# Altium project Length Bar Comparator.PrjPcb (part 2 of 3)

## Sheet Stepping Motor DriverF.SchDoc
size A4
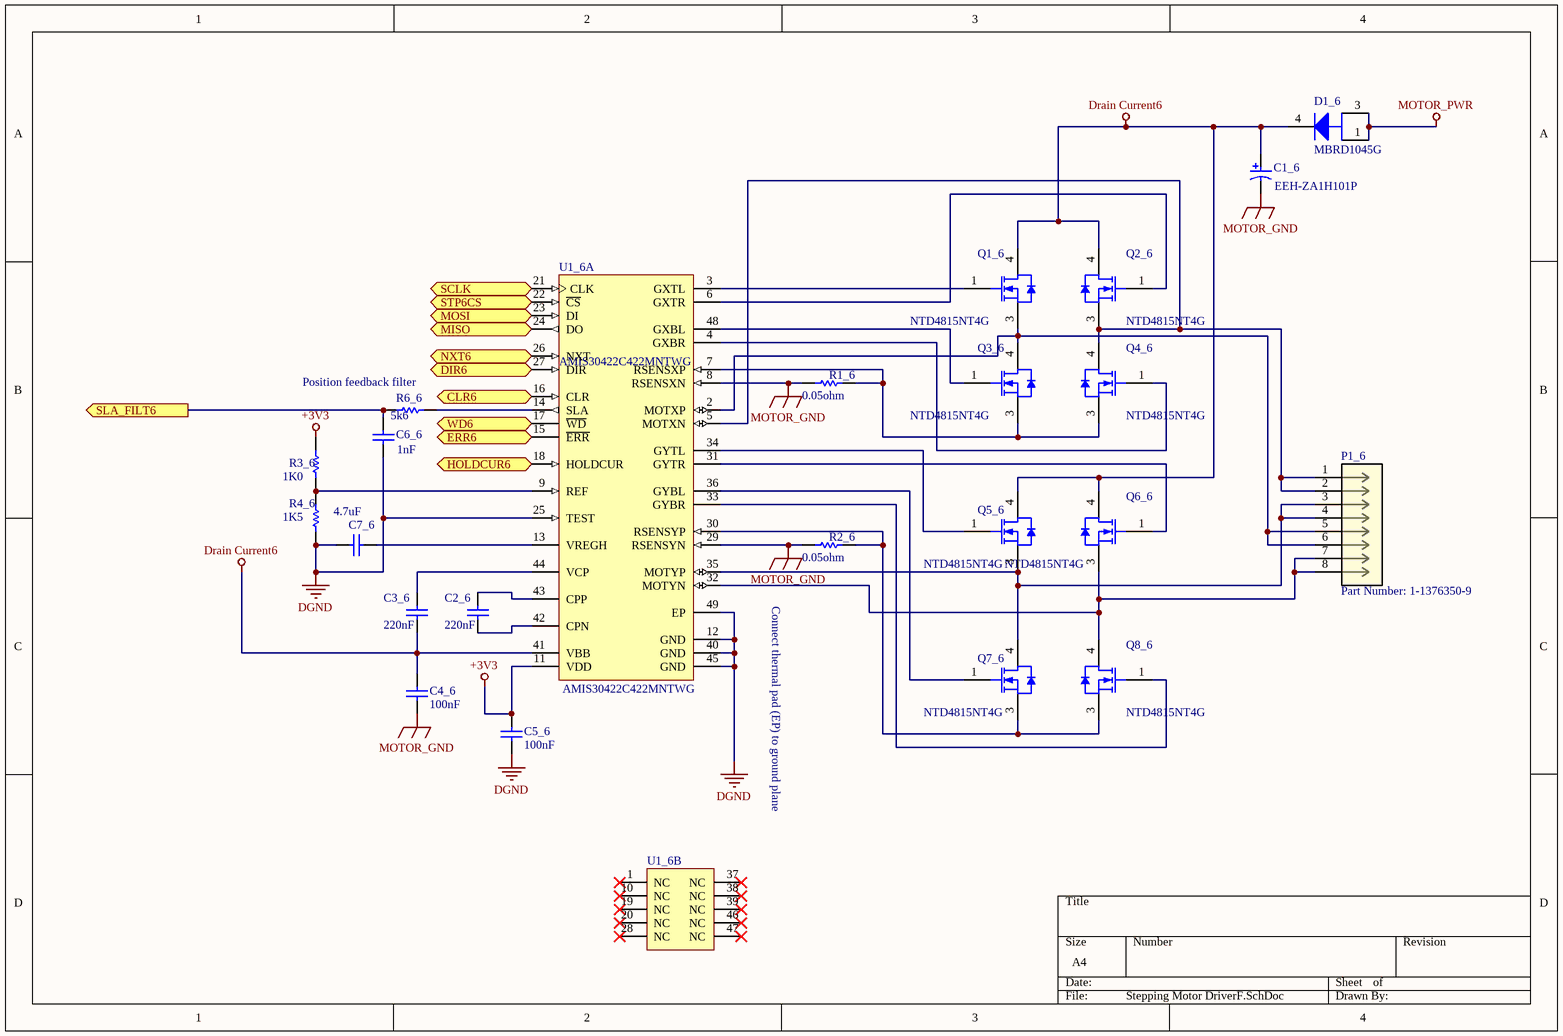
[diagram p5: Stepping Motor DriverF.SchDoc]

### Parts
C1_6  EEH-ZA1H101P  [PNSC-ZA-G_L]
C2_6  value 220nF  [CAPC0805(2012)75_L]  (hidden comment: CAP 220nF 50V 0805(2012))
C3_6  value 220nF  [CAPC0805(2012)75_L]  (hidden comment: CAP 220nF 50V 0805(2012))
C4_6  value 100nF  [CAPC1812(4532)110_N]  (hidden comment: CAP 100nF 50V 1812(4532))
C5_6  value 100nF  [CAPC1812(4532)110_N]  (hidden comment: CAP 100nF 50V 1812(4532))
C6_6  value 1nF  [CAPC1206(3216)170_N]  (hidden comment: CAP 1nF 50V 1206(3216))
C7_6  value 4.7uF  [CAPC2220(5750)230_L]  (hidden comment: CAP 4.7uF 50V 2220(5750))
D1_6  MBRD1045G  [ONSC-DPAK-3-369C-01_V]
P1_6  Part Number: 1-1376350-9  [conn8_1-1376350-]
Q1_6  NTD4815NT4G  [ONSC-DPAK-3-369AA-01_V]
Q2_6  NTD4815NT4G  [ONSC-DPAK-3-369AA-01_V]
Q3_6  NTD4815NT4G  [ONSC-DPAK-3-369AA-01_V]
Q4_6  NTD4815NT4G  [ONSC-DPAK-3-369AA-01_V]
Q5_6  NTD4815NT4G  [ONSC-DPAK-3-369AA-01_V]
Q6_6  NTD4815NT4G  [ONSC-DPAK-3-369AA-01_V]
Q7_6  NTD4815NT4G  [ONSC-DPAK-3-369AA-01_V]
Q8_6  NTD4815NT4G  [ONSC-DPAK-3-369AA-01_V]
R1_6  Resistance: 0.05ohm  [RESC6432X89X76LL25T25]  (hidden comment: WSL2512R0500FEA)
R2_6  Resistance: 0.05ohm  [RESC6432X89X76LL25T25]  (hidden comment: WSL2512R0500FEA)
R3_6  value 1K0  [RESC0805(2012)_M]  (hidden comment: 1K 1% 0805(2012))
R4_6  value 1K5  [RESC0805(2012)_M]  (hidden comment: 1K5 1% 0805(2012))
R6_6  value 5k6  [RESC0805(2012)_L]  (hidden comment: 5K6 1% 0805(2012))
U1_6  AMIS30422C422MNTWG  [ONSC-QFN-48-485AJ-01_V]  (parts A,B of 2)

### Ports
CLR6 (in), DIR6 (in), ERR6 (out), HOLDCUR6 (in), MISO (out), MOSI (in), NXT6 (in), SCLK (in), SLA_FILT6 (out), STP6CS (in), WD6 (out)

### Nets
+3V3: C5_6.2 R3_6.2 U1_6.11(VDD)
DGND: C5_6.1 C6_6.1 C7_6.1 R4_6.1 U1_6.12(GND) U1_6.25(TEST) U1_6.40(GND) U1_6.45(GND) U1_6.49(EP)
Drain Current6: C1_6.1 C3_6.1 C4_6.2 D1_6.4(K) Q1_6.4(D) Q2_6.4(D) Q5_6.4(D) Q6_6.4(D) U1_6.41(VBB)
MOTOR_GND: C1_6.2 C4_6.1 R1_6.1 R2_6.1 U1_6.8(RSENSXN) U1_6.29(RSENSYN)
MOTOR_PWR: D1_6.1(A) D1_6.3(A)
MISO: U1_6.24(DO) ; port MISO
MOSI: U1_6.23(DI) ; port MOSI
SCLK: U1_6.21(CLK) ; port SCLK
NetC2_6_1: C2_6.1 U1_6.42(CPN)
NetC2_6_2: C2_6.2 U1_6.43(CPP)
NetC3_6_2: C3_6.2 U1_6.44(VCP)
NetC6_6_2: C6_6.2 R6_6.1 ; port SLA_FILT6
NetC7_6_2: C7_6.2 U1_6.13(VREGH)
NetP1_6_1: P1_6.1 P1_6.2 Q2_6.3(S) Q4_6.4(D) U1_6.5(MOTXN)
NetP1_6_3: P1_6.3 P1_6.4 Q5_6.3(S) Q7_6.4(D) U1_6.35(MOTYP)
NetP1_6_5: P1_6.5 P1_6.6 Q1_6.3(S) Q3_6.4(D) U1_6.2(MOTXP)
NetP1_6_7: P1_6.7 P1_6.8 Q6_6.3(S) Q8_6.4(D) U1_6.32(MOTYN)
NetQ1_6_1: Q1_6.1(G) U1_6.3(GXTL)
NetQ2_6_1: Q2_6.1(G) U1_6.6(GXTR)
NetQ3_6_1: Q3_6.1(G) U1_6.48(GXBL)
NetQ3_6_3: Q3_6.3(S) Q4_6.3(S) R1_6.2 U1_6.7(RSENSXP)
NetQ4_6_1: Q4_6.1(G) U1_6.4(GXBR)
NetQ5_6_1: Q5_6.1(G) U1_6.34(GYTL)
NetQ6_6_1: Q6_6.1(G) U1_6.31(GYTR)
NetQ7_6_1: Q7_6.1(G) U1_6.36(GYBL)
NetQ7_6_3: Q7_6.3(S) Q8_6.3(S) R2_6.2 U1_6.30(RSENSYP)
NetQ8_6_1: Q8_6.1(G) U1_6.33(GYBR)
NetR3_6_1: R3_6.1 R4_6.2 U1_6.9(REF)
NetR6_6_2: R6_6.2 U1_6.14(SLA)
NetU1_6_15: U1_6.15(~{ERR}) ; port ERR6
NetU1_6_16: U1_6.16(CLR) ; port CLR6
NetU1_6_17: U1_6.17(~{WD}) ; port WD6
NetU1_6_18: U1_6.18(HOLDCUR) ; port HOLDCUR6
NetU1_6_22: U1_6.22(~{CS}) ; port STP6CS
NetU1_6_26: U1_6.26(NXT) ; port NXT6
NetU1_6_27: U1_6.27(DIR) ; port DIR6

Not connected (* = marked no-connect by the designer): U1_6 1(NC)* 10(NC)* 19(NC)* 20(NC)* 28(NC)* 37(NC)* 38(NC)* 39(NC)* 46(NC)* 47(NC)*

### Notes on the sheet
- (near R6_6) Position feedback filter
- Connect thermal pad (EP) to ground plane

### Library data of the parts
C1_6 = CMP-2000-06221-1: Conductive Polymer Hybrid Aluminum Electrolytic Capacitor, 100 uF, +/- 20%, 50 V, -55 to 105 degC, 2-Pin SMD (G), RoHS, Tape and Reel; Case Height: 10.5mm; Voltage Rating DC: 50V; Case Diameter: 10mm; Ripple Current: 2A; Load Life: 10000Hour; Brand: Panasonic; Case Length: 10.2mm; ESR: 28mOhms; Capacitance: 100uF; Manufacturer URL: http://www.panasonic.com/; Minimum Operating Temperature: -55C; Datasheet Version: 06/2016; Product Category: AluminumOrganicPolymerCapacitors; Maximum Operating Temperature: +105C; Package Description: 2-Pin Surface Mount Device, Body 10.3 x 10.3 mm; Package Reference: ZA-G; RoHS: Details; Series: ZA; Tolerance: 20%; Product: AluminumElectrolyticCapacitors; Factory Pack Quantity: 500; Manufacturer: Panasonic; Termination Style: SMD/SMT; Datasheet URL: https://industrial.panasonic.com/cdbs/www-data/pdf/RDD0000/DMD0000COL56.pdf; Mounting Technology: SurfaceMount; Packaging: Reel; Height: 10.5mm
C2_6 C3_6 = CMP-1036-04556-1: CAP 220nF 50V -20% to +80% 0805 (2012 Metric) Thickness 0.75mm SMD; Case-Metric: 2012; Case-EIA: 0805; Technology: SMT; Max Thickness: 0.75 mm; Rated Voltage: 50 V; Tolerance: -20% to +80%
C4_6 C5_6 = CMP-1040-01292-1: CAP 100nF 50V ±20% 1812 (4532 Metric) Thickness 1.1mm SMD; Case-EIA: 1812; Tolerance: Â±20%; Case-Metric: 4532; Rated Voltage: 50 V; Technology: SMT; Max Thickness: 1.1 mm
C6_6 = CMP-1037-02447-1: CAP 1nF 50V ±2% 1206 (3216 Metric) Thickness 1.7mm SMD; Case-Metric: 3216; Case-EIA: 1206; Tolerance: Â±2%; Technology: SMT; Max Thickness: 1.7 mm; Rated Voltage: 50 V
C7_6 = CMP-1042-00755-1: as C7_1 on sheet Stepping Motor DriverA; Rated Voltage: 50 V; Max Thickness: 2.2 mm; Technology: SMT
D1_6 = CMP-1055-00174-1: SWITCHMODE(TM) Schottky Power Rectifier, 3-Pin DPAK, Pb-Free, Tube; Manufacturer: On Semiconductor; Note1: 0; IFSM Max (A): 70; Configuration: Single; ComponentLink2URL: http://www.onsemi.cn/pub_link/Collateral/MBRB1045-D.PDF; PackageVersion: Rev. E, 02/2014; PackageDescription: 3-Pin Flange Mount, Body 6.54 x 6.095 mm, Pitch 2.29 mm; ComponentLink2Description: Datasheet; Packing: Tube; RoHS: TRUE; ComponentLink3Description: Package Specification; PackageReference: DPAK-3-369C-01; ComponentLink1URL: http://www.onsemi.com/; DatasheetVersion: Rev. 8; ComponentLink1Description: Manufacturer URL; PartNumber: MBRD1045G; Mounting Technology: Surface Mount; ComponentLink3URL: http://www.onsemi.cn/pub_link/Collateral/369C.PDF
P1_6 = 1-1376350-9: 025 8POS CAP ASSY H TIN; Vendor: TE Connectivity; Built_By: Digital_Papaya_Team; ROWS/CONFIG: 2; PITCH(MM): 0.087; POSITIONS: 8; Copyright: Copyright (C) 2018 Accelerated Designs. All rights reserved; Manufacturer_Part_Number: 1-1376350-9; Datasheet: https://www.te.com/commerce/DocumentDelivery/DDEController?Action=showdoc&DocId=Customer+Drawing%7F1376350%7FD5%7Fpdf%7FJapanese%7FJPN_CD_1376350_D5.pdf%7F1-1376350-2; TE_Part_Number: 1-1376350-9; PRODUCT: -; Type: DEV; RefDes: RefDes; Value: Value
Q1_6 Q2_6 Q3_6 Q4_6 Q5_6 Q6_6 Q7_6 Q8_6 = CMP-1058-00298-1: Power MOSFET, 30 V, 35 A, Single N-Channel, 3-Pin DPAK, Pb-Free, Tape and Reel; Manufacturer: On Semiconductor; VGS(th) Max (V): 2.5; VGS Max (V): 20; ID Max (A): 35; Crss Typ (pF): 108; Coss Typ (pF): 181; Channel Polarity: N Channel; V(BR)DSS Min (V): 30; Ciss Typ (pF): 770; Qrr Typ (nC): 5.5; RoHS: Pb-Free; ComponentLink3Description: Package Specification; ComponentLink2URL: http://www.onsemi.cn/pub_link/Collateral/NTD4815N-D.PDF; ComponentLink1Description: Manufacturer URL; DatasheetVersion: Rev. 7; ComponentLink3URL: http://www.onsemi.cn/pub_link/Collateral/369AA.PDF; Package Type: DPAK-3, IPAK-3; PartNumber: NTD4815NT4G; Configuration: Single; PackageVersion: Rev. B, 06/2010; ComponentLink2Description: Datasheet; Mounting Technology: Surface Mount; PackageReference: DPAK-3-369AA-01; ComponentLink1URL: http://www.onsemi.com/; PackageDescription: 3-Pin Flange Mount, Body 6.54 x 6.095 mm, Pitch 2.29 mm; Packing: Tape and Reel
R1_6 R2_6 = CMP-2000-07420-1: Chip Resistor, 50 mOhm, +/- 1%, 1 W, -65 to 170 degC, 2512 (6432 Metric), RoHS, Tape and Reel; Manufacturer: Vishay; Power Rating: 1W; Automotive Qualification Standard: AEC-Q200; Temperature Coefficient: ±75ppm/°C; Resistor Case Style: 2512[6432Metric]; SVHC: NoSVHC(15-Jun-2015); Product Range: WSLSeries; Resistor Element Type: MetalStrip; Manufacturer URL: http://www.vishay.com/; Datasheet Version: 07/2016; Package Reference: 2512; Resistance Tolerance: ±1%; Datasheet URL: http://www.vishay.com/docs/30100/wsl.pdf; Mounting Technology: SurfaceMount; MSL: MSL1-Unlimited; Package Description: 2-Pin Surface Mount Device, Body 6.35 x 3.18 mm; Packaging: CutTape
R3_6 = CMP-1013-00510-1: 1K 0.125W 1% 0805 (2012 Metric)  SMD; Case-Metric: 2012; Case-EIA: 0805; Tolerance: 1 %; Power: 0.125 W; Technology: SMT
R4_6 = CMP-1013-00528-1: 1K5 0.125W 1% 0805 (2012 Metric)  SMD; Case-Metric: 2012; Case-EIA: 0805; Technology: SMT; Power: 0.125 W; Tolerance: 1 %
R6_6 = CMP-1013-00595-1: as R6_1 on sheet Stepping Motor DriverA; Technology: SMT; Power: 0.125 W; Tolerance: 1 %
U1_6 = CMP-1325-00002-1: Micro-Stepping Stepper Motor Bridge Controller, 6 to 30 V, -40 to 170 degC, 48-Pin QFN (485AJ-01), RoHS, Tape and Reel; Manufacturer: ON Semiconductor; IO Max (A): 15; Feedback Method: Back EMF/Sensorless; VCC Min (V): 6; IO Peak Max (A): 20; Current Sense: External Resistor; VCC Max (V): 30; ComponentLink1Description: Manufacturer URL; DatasheetVersion: Rev. 0; PackageDescription: 48-Pin Quad Flat No-Lead Package, Body 7 x 7 mm, Pitch 0.5 mm; Packing: Tape and Reel; Mounting Technology: Surface Mount; ComponentLink2Description: Datasheet; ComponentLink3URL: http://www.onsemi.cn/pub_link/Collateral/485AJ.PDF; Type: Stepper; ComponentLink2URL: http://www.onsemi.com/pub_link/Collateral/AMIS-30422-D.PDF; ComponentLink3Description: Package Specification; PackageReference: QFN-48-485AJ-01; PartNumber: AMIS30422C422MNTWG; PackageVersion: Rev. O; ComponentLink1URL: http://www.onsemi.com/; RoHS: TRUE; PartId: 1

## Sheet Microprocessor.SchDoc
size A1
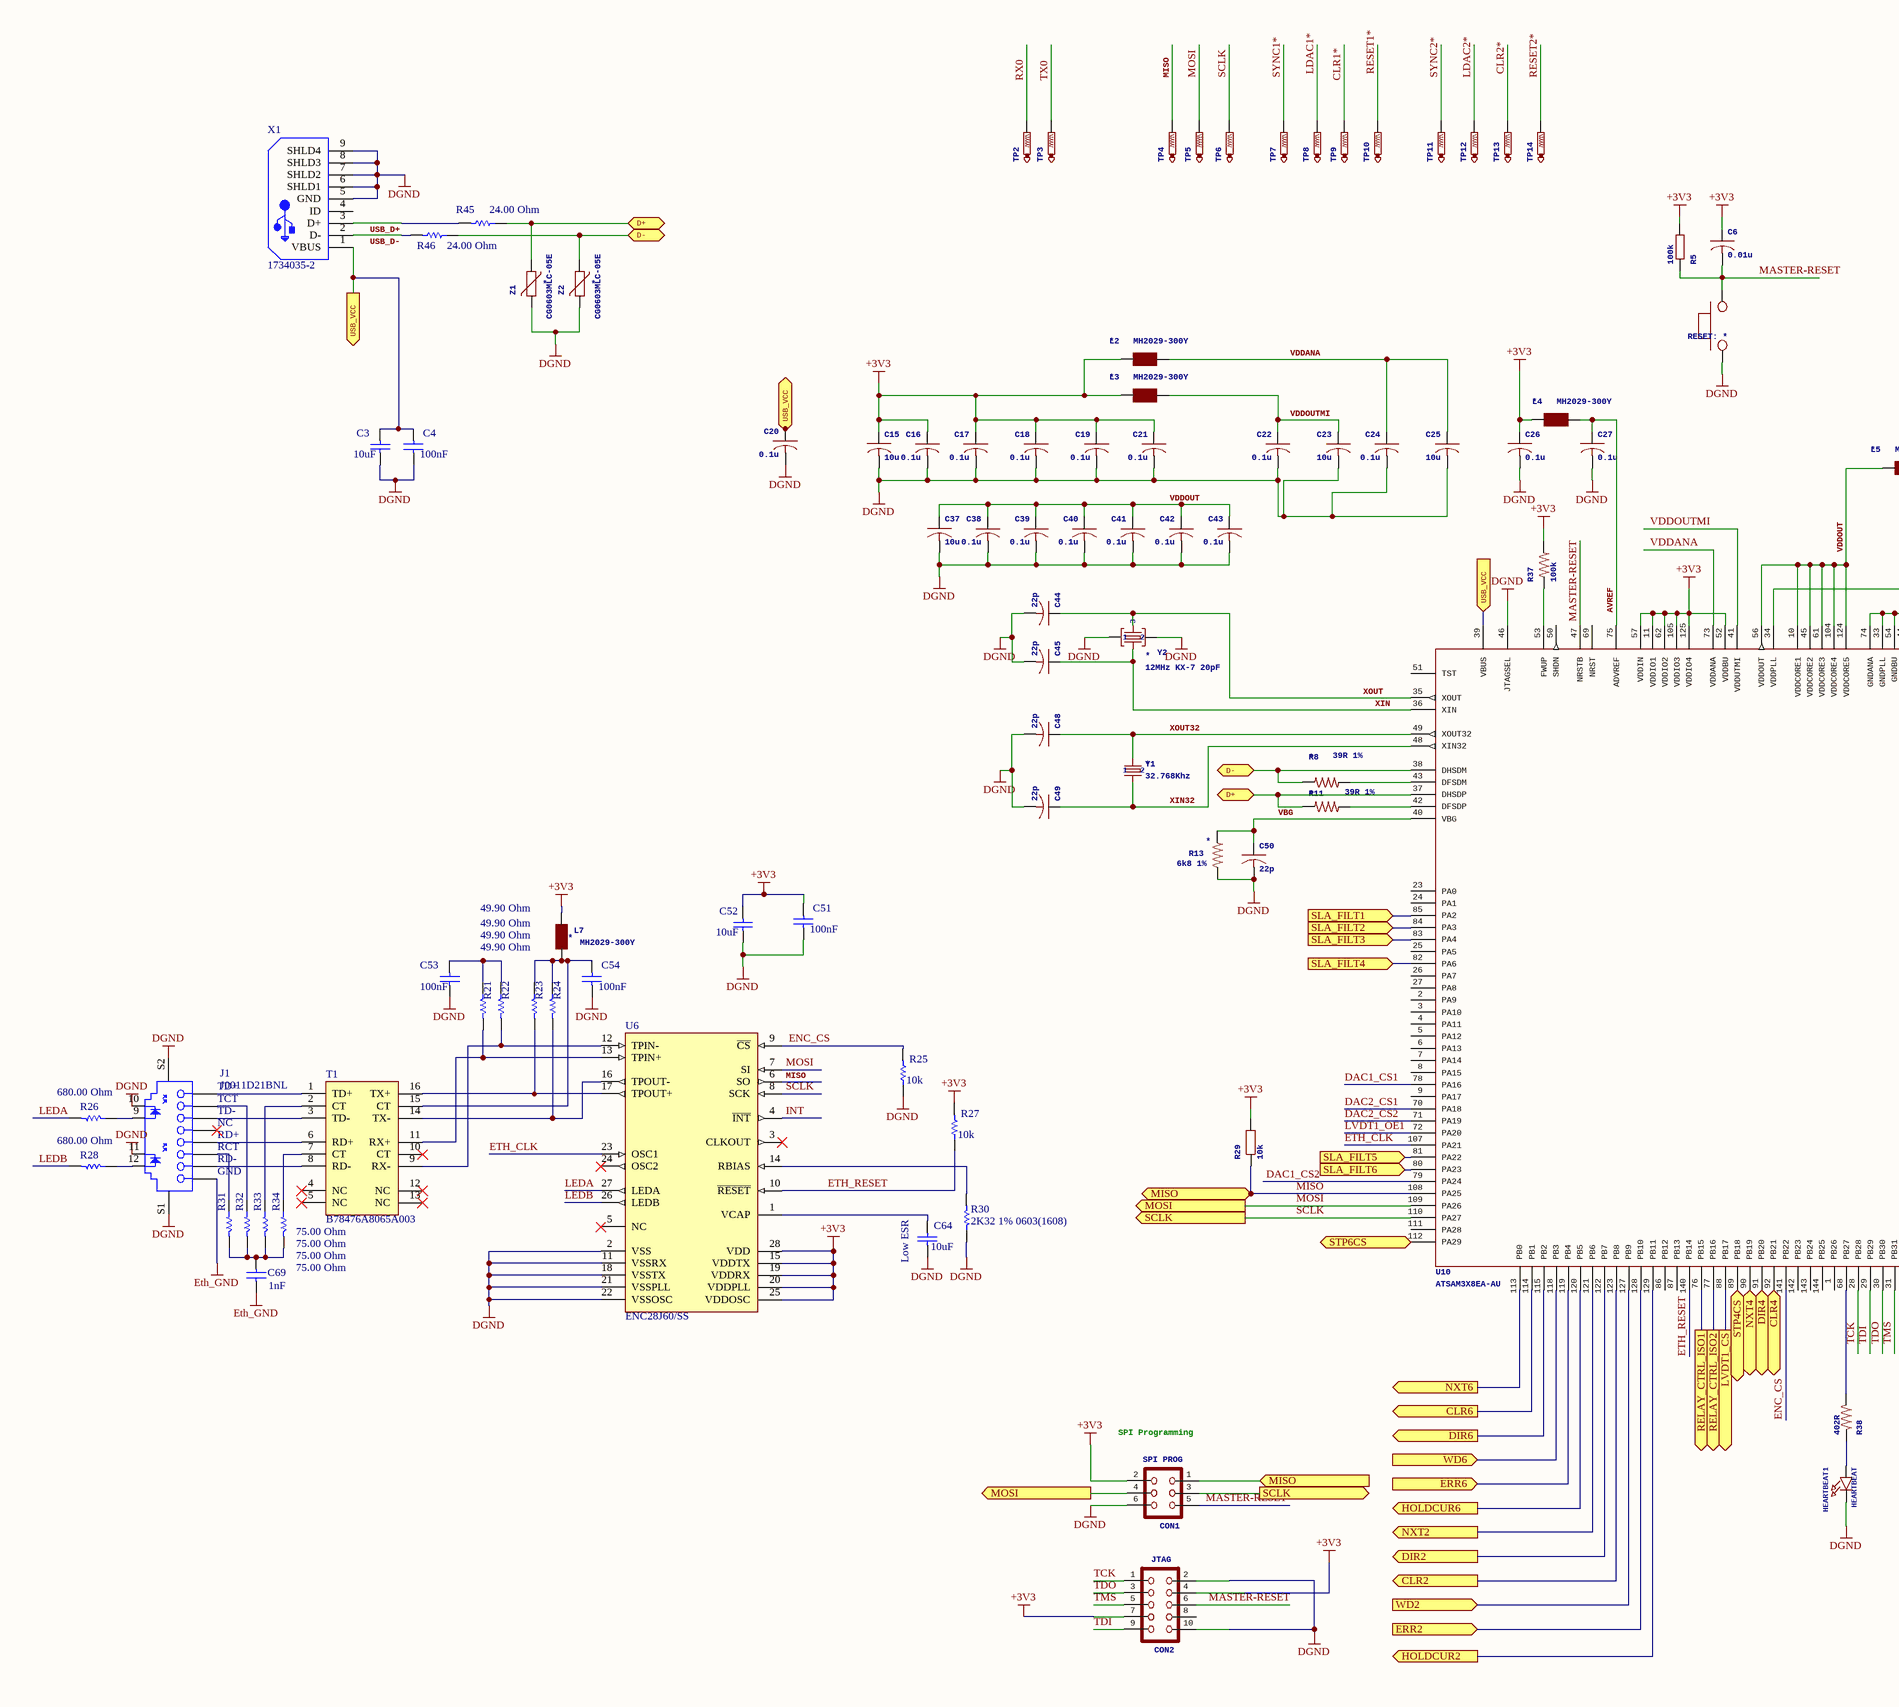
[diagram p6: Microprocessor.SchDoc, left]
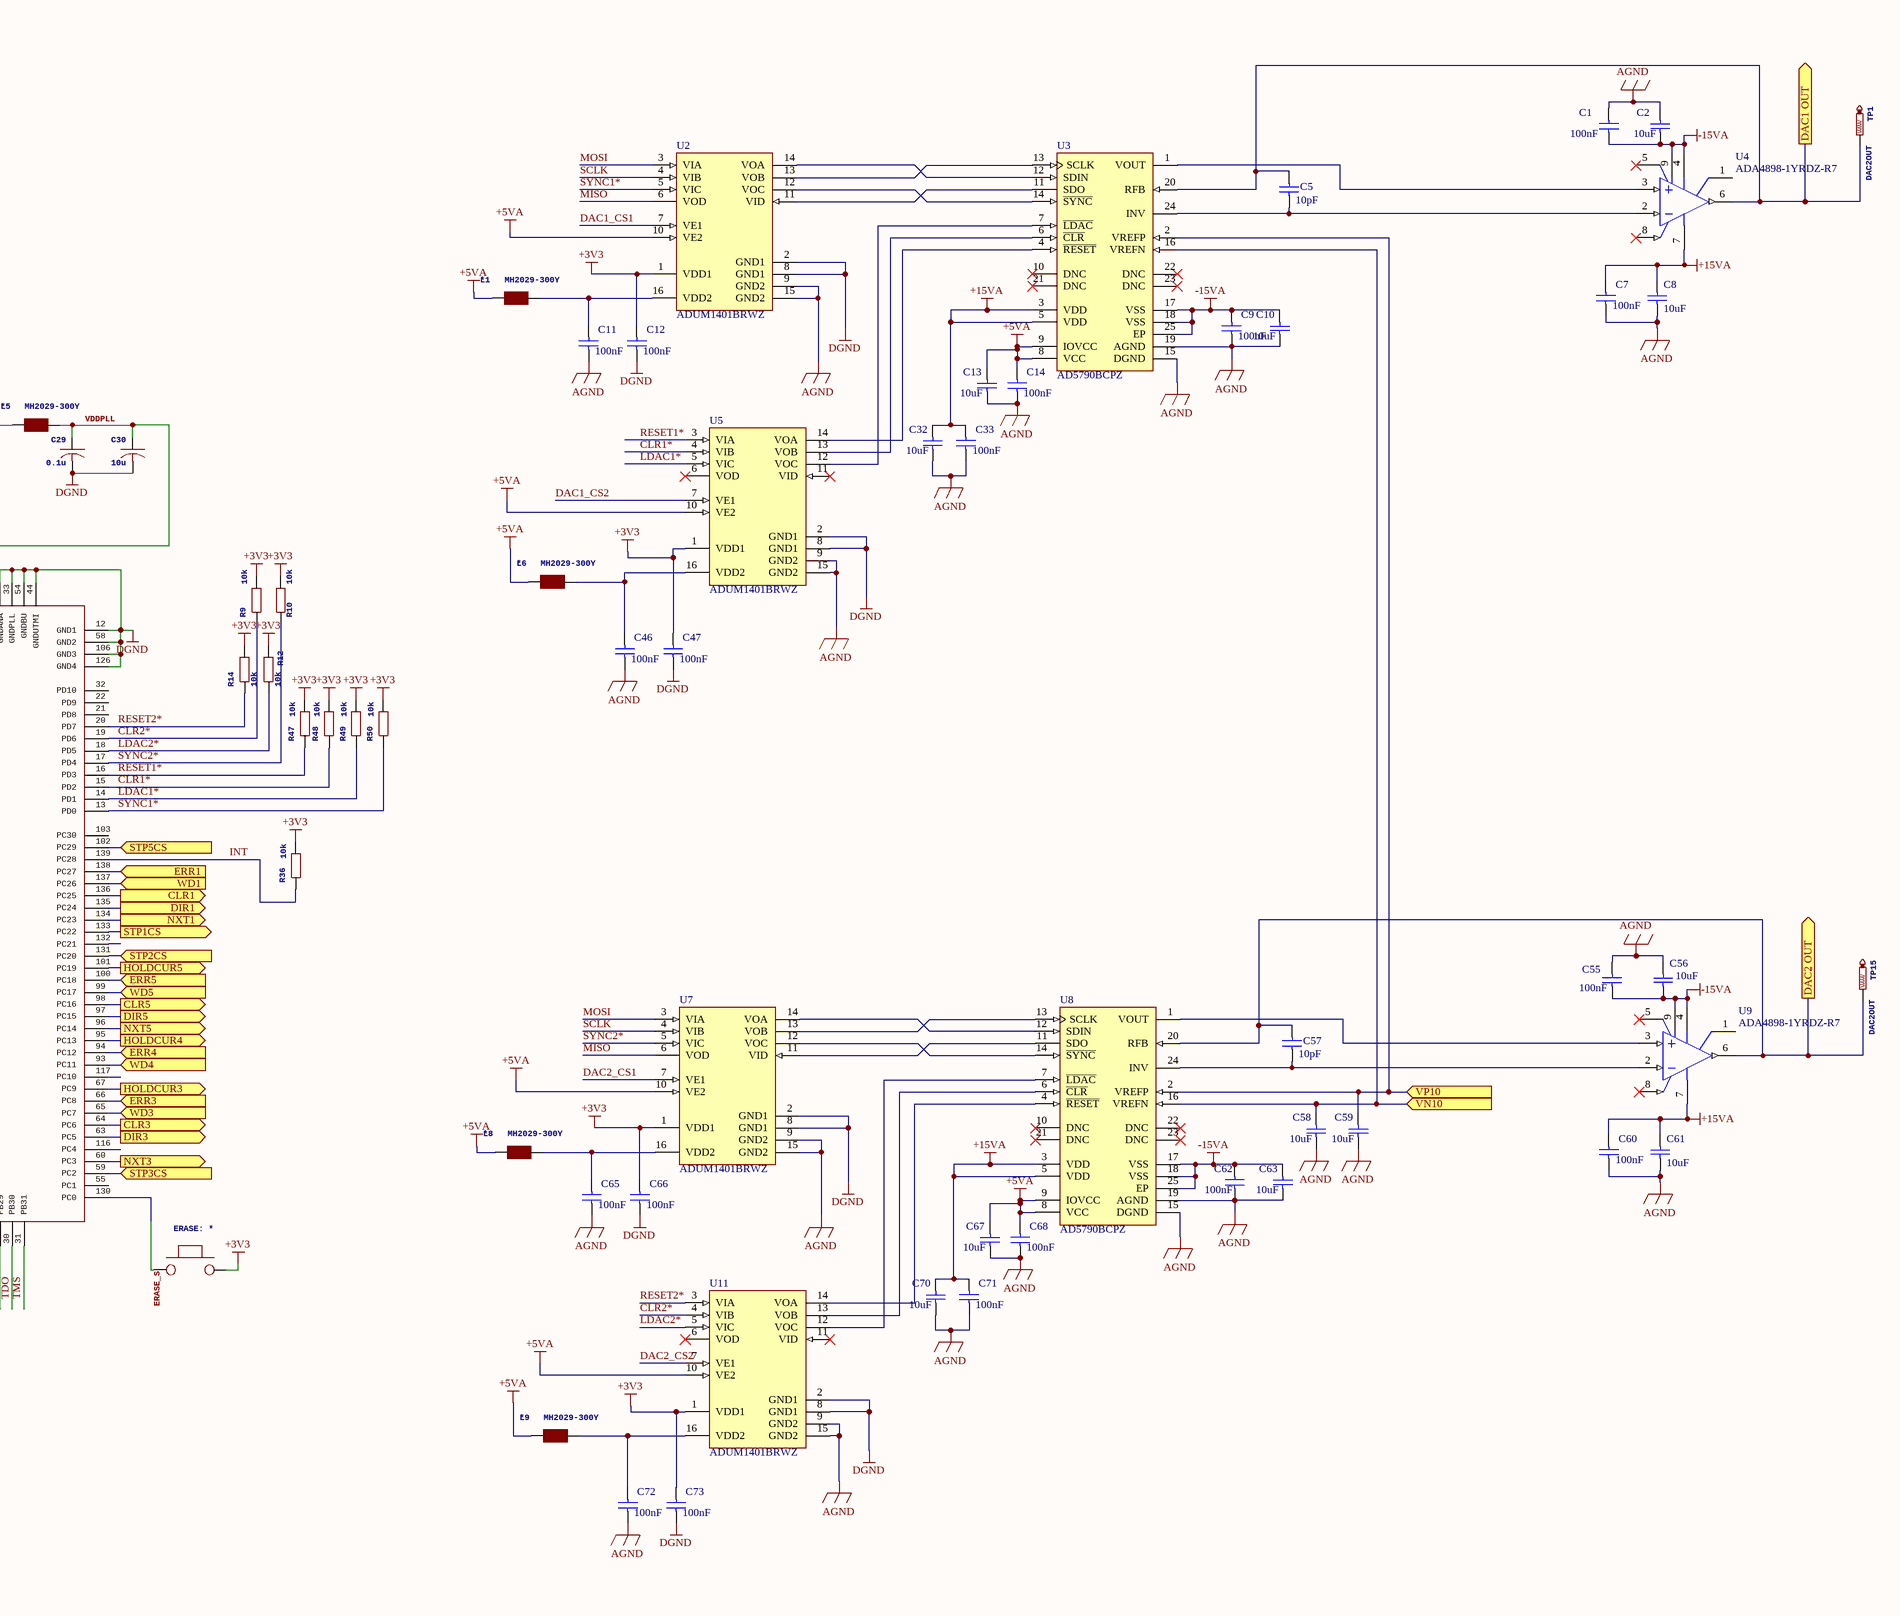
[diagram p7: Microprocessor.SchDoc, right]

### Parts
C1  value 100nF  [CAPC0603(1608)100_N]  (hidden comment: CAP 100nF 25V 0603(1608))
C2  value 10uF  [CAPC0805(2012)145_N]  (hidden comment: CAP 10uF 6.3V 0805(2012))
C3  value 10uF  [CAPC0805(2012)145_N]  (hidden comment: CAP 10uF 6.3V 0805(2012))
C4  value 100nF  [CAPC0603(1608)100_N]  (hidden comment: CAP 100nF 25V 0603(1608))
C5  value 10pF  [CAPC0805(2012)100_M]  (hidden comment: CAP 10pF 25V 0805(2012))
C6  0.01u  [C0805]
C7  value 100nF  [CAPC0603(1608)100_N]  (hidden comment: CAP 100nF 25V 0603(1608))
C8  value 10uF  [CAPC0805(2012)145_N]  (hidden comment: CAP 10uF 6.3V 0805(2012))
C9  value 100nF  [CAPC0603(1608)100_N]  (hidden comment: CAP 100nF 25V 0603(1608))
C10  value 10uF  [CAPC0805(2012)145_N]  (hidden comment: CAP 10uF 6.3V 0805(2012))
C11  value 100nF  [CAPC0603(1608)100_N]  (hidden comment: CAP 100nF 25V 0603(1608))
C12  value 100nF  [CAPC0603(1608)100_N]  (hidden comment: CAP 100nF 25V 0603(1608))
C13  value 10uF  [CAPC0805(2012)145_N]  (hidden comment: CAP 10uF 6.3V 0805(2012))
C14  value 100nF  [CAPC0603(1608)100_N]  (hidden comment: CAP 100nF 25V 0603(1608))
C15  10u  [C0805]
C16  0.1u  [C0805]
C17  0.1u  [C0805]
C18  0.1u  [C0805]
C19  0.1u  [C0805]
C20  0.1u  [C0805]
C21  0.1u  [C0805]
C22  0.1u  [C0805]
C23  10u  [C0805]
C24  0.1u  [C0805]
C25  10u  [C0805]
C26  0.1u  [C0805]
C27  0.1u  [C0805]
C29  0.1u  [C0805]
C30  10u  [C0805]
C32  value 10uF  [CAPC0805(2012)145_N]  (hidden comment: CAP 10uF 6.3V 0805(2012))
C33  value 100nF  [CAPC0603(1608)100_N]  (hidden comment: CAP 100nF 25V 0603(1608))
C37  10u  [C0805]
C38  0.1u  [C0805]
C39  0.1u  [C0805]
C40  0.1u  [C0805]
C41  0.1u  [C0805]
C42  0.1u  [C0805]
C43  0.1u  [C0805]
C44  22p  [C1206]
C45  22p  [C1206]
C46  value 100nF  [CAPC0603(1608)100_N]  (hidden comment: CAP 100nF 25V 0603(1608))
C47  value 100nF  [CAPC0603(1608)100_N]  (hidden comment: CAP 100nF 25V 0603(1608))
C48  22p  [C0805]
C49  22p  [C0805]
C50  22p  [C0805]
C51  value 100nF  [CAPC0603(1608)100_N]  (hidden comment: CAP 100nF 25V 0603(1608))
C52  value 10uF  [CAPC0805(2012)145_N]  (hidden comment: CAP 10uF 6.3V 0805(2012))
C53  value 100nF  [CAPC0603(1608)100_N]  (hidden comment: CAP 100nF 25V 0603(1608))
C54  value 100nF  [CAPC0603(1608)100_N]  (hidden comment: CAP 100nF 25V 0603(1608))
C55  value 100nF  [CAPC0603(1608)100_N]  (hidden comment: CAP 100nF 25V 0603(1608))
C56  value 10uF  [CAPC0805(2012)145_N]  (hidden comment: CAP 10uF 6.3V 0805(2012))
C57  value 10pF  [CAPC0805(2012)100_M]  (hidden comment: CAP 10pF 25V 0805(2012))
C58  value 10uF  [CAPC0805(2012)145_N]  (hidden comment: CAP 10uF 6.3V 0805(2012))
C59  value 10uF  [CAPC0805(2012)145_N]  (hidden comment: CAP 10uF 6.3V 0805(2012))
C60  value 100nF  [CAPC0603(1608)100_N]  (hidden comment: CAP 100nF 25V 0603(1608))
C61  value 10uF  [CAPC0805(2012)145_N]  (hidden comment: CAP 10uF 6.3V 0805(2012))
C62  value 100nF  [CAPC0603(1608)100_N]  (hidden comment: CAP 100nF 25V 0603(1608))
C63  value 10uF  [CAPC0805(2012)145_N]  (hidden comment: CAP 10uF 6.3V 0805(2012))
C64  value 10uF  [CAPC1206(3216)190_M]  (hidden comment: CAP 10uF 6.3V 1206(3216))
C65  value 100nF  [CAPC0603(1608)100_N]  (hidden comment: CAP 100nF 25V 0603(1608))
C66  value 100nF  [CAPC0603(1608)100_N]  (hidden comment: CAP 100nF 25V 0603(1608))
C67  value 10uF  [CAPC0805(2012)145_N]  (hidden comment: CAP 10uF 6.3V 0805(2012))
C68  value 100nF  [CAPC0603(1608)100_N]  (hidden comment: CAP 100nF 25V 0603(1608))
C69  Capacitance: 1nF  [CAPC3317X180X60LL30T20]  (hidden comment: 1206GC102KAZ1A)
C70  value 10uF  [CAPC0805(2012)145_N]  (hidden comment: CAP 10uF 6.3V 0805(2012))
C71  value 100nF  [CAPC0603(1608)100_N]  (hidden comment: CAP 100nF 25V 0603(1608))
C72  value 100nF  [CAPC0603(1608)100_N]  (hidden comment: CAP 100nF 25V 0603(1608))
C73  value 100nF  [CAPC0603(1608)100_N]  (hidden comment: CAP 100nF 25V 0603(1608))
CON1  SPI PROG  [CON06]
CON2  JTAG  [CON10]
ERASE1  PUCHBUTTON  [PUCHBUTTON]  (value not drawn)
HEARTBEAT1  HEARTBEAT  [CHIPLED_0805]
J1  J0011D21BNL  [PULS-J00XXD21XNL-B-12]
L1  MH2029-300Y  [0805]
L2  MH2029-300Y  [0805]
L3  MH2029-300Y  [0805]
L4  MH2029-300Y  [0805]
L5  MH2029-300Y  [0805]
L6  MH2029-300Y  [0805]
L7  MH2029-300Y  [0805]
L8  MH2029-300Y  [0805]
L9  MH2029-300Y  [0805]
R5  100k  [R0603]
R8  39R 1%  [R0805]
R9  10k  [R0603]
R10  10k  [R0603]
R11  39R 1%  [R0805]
R12  10k  [R0603]
R13  6k8 1%  [R0805]
R14  10k  [R0603]
R21  value 49.90 Ohm  [RESC0603(1608)_N]  (hidden comment: 49R9 1% 0603(1608))
R22  value 49.90 Ohm  [RESC0603(1608)_N]  (hidden comment: 49R9 1% 0603(1608))
R23  value 49.90 Ohm  [RESC0603(1608)_N]  (hidden comment: 49R9 1% 0603(1608))
R24  value 49.90 Ohm  [RESC0603(1608)_N]  (hidden comment: 49R9 1% 0603(1608))
R25  Resistance (Ohms): 10k  [RESC1608X55X30LL10T20_A]  (hidden comment: MCR03ERTF1002)
R26  value 680.00 Ohm  [RESC0603(1608)_N]  (hidden comment: 680R 1% 0603(1608))
R27  Resistance (Ohms): 10k  [RESC1608X55X30LL10T20_A]  (hidden comment: MCR03ERTF1002)
R28  value 680.00 Ohm  [RESC0603(1608)_N]  (hidden comment: 680R 1% 0603(1608))
R29  10k  [R0603]
R30  2K32 1% 0603(1608)  [RESC0603(1608)_L]
R31  value 75.00 Ohm  [RESC0603(1608)_M]  (hidden comment: 75R 1% 0603(1608))
R32  value 75.00 Ohm  [RESC0603(1608)_M]  (hidden comment: 75R 1% 0603(1608))
R33  value 75.00 Ohm  [RESC0603(1608)_M]  (hidden comment: 75R 1% 0603(1608))
R34  value 75.00 Ohm  [RESC0603(1608)_M]  (hidden comment: 75R 1% 0603(1608))
R36  10k  [R0603]
R37  100k  [R0805]
R38  402R  [R0805]
R45  value 24.00 Ohm  [RESC0603(1608)_N]  (hidden comment: 24R 5% 0603(1608))
R46  value 24.00 Ohm  [RESC0603(1608)_N]  (hidden comment: 24R 5% 0603(1608))
R47  10k  [R0603]
R48  10k  [R0603]
R49  10k  [R0603]
R50  10k  [R0603]
RESET1  PUCHBUTTON  [PUCHBUTTON]  (value not drawn)
T1  B78476A8065A003  [EPCS-B78476A8065A003-16]
TP1  TP_SIGNAL_NAME: DAC2OUT  [P1-13]  (hidden comment: PTR1PAD1-13)
TP2  PTR1PAD1-13  [P1-13]  (value not drawn)
TP3  PTR1PAD1-13  [P1-13]  (value not drawn)
TP4  PTR1PAD1-13  [P1-13]  (value not drawn)
TP5  PTR1PAD1-13  [P1-13]  (value not drawn)
TP6  PTR1PAD1-13  [P1-13]  (value not drawn)
TP7  PTR1PAD1-13  [P1-13]  (value not drawn)
TP8  PTR1PAD1-13  [P1-13]  (value not drawn)
TP9  PTR1PAD1-13  [P1-13]  (value not drawn)
TP10  PTR1PAD1-13  [P1-13]  (value not drawn)
TP11  PTR1PAD1-13  [P1-13]  (value not drawn)
TP12  PTR1PAD1-13  [P1-13]  (value not drawn)
TP13  PTR1PAD1-13  [P1-13]  (value not drawn)
TP14  PTR1PAD1-13  [P1-13]  (value not drawn)
TP15  TP_SIGNAL_NAME: DAC2OUT  [P1-13]  (hidden comment: PTR1PAD1-13)
U2  ADUM1401BRWZ  [ADI-RW-16_M]
U3  AD5790BCPZ  [CP-24-5_N]
U4  ADA4898-1YRDZ-R7  [ADI-RD-8-1_N]
U5  ADUM1401BRWZ  [ADI-RW-16_M]
U6  ENC28J60/SS  [SSOP-SS28_M]
U7  ADUM1401BRWZ  [ADI-RW-16_M]
U8  AD5790BCPZ  [CP-24-5_N]
U9  ADA4898-1YRDZ-R7  [ADI-RD-8-1_N]
U10  ATSAM3X8EA-AU  [LQFP144]
U11  ADUM1401BRWZ  [ADI-RW-16_M]
X1  1734035-2  [TECO-1734035-2-5_V]
Y1  32.768Khz  [ARDUINO_WIFI_SHIELD_V018_TG_RESONATOR_EPSON_FC_145]
Y2  12MHz KX-7 20pF  [CRYSTAL-3.2-2.5]
Z1  CG0603MLC-05E  [CT/CN0603]
Z2  CG0603MLC-05E  [CT/CN0603]

### Ports
CLR1 (out), CLR2 (out), CLR3 (out), CLR4 (out), CLR5 (out), CLR6 (out), D+, D-, DAC1 OUT (out), DAC2 OUT (out), DIR1 (out), DIR2 (out), DIR3 (out), DIR4 (out), DIR5 (out), DIR6 (out), ERR1 (in), ERR2 (in), ERR3 (in), ERR4 (in), ERR5 (in), ERR6 (in), HOLDCUR2 (out), HOLDCUR3 (out), HOLDCUR4 (out), HOLDCUR5 (out), HOLDCUR6 (out), LVDT1_CS (out), MISO (in), MOSI (out), NXT1 (out), NXT2 (out), NXT3 (out), NXT4 (out), NXT5 (out), NXT6 (out), RELAY_CTRL_ISO1 (out), RELAY_CTRL_ISO2 (out), SCLK (out), SLA_FILT1 (in), SLA_FILT2 (in), SLA_FILT3 (in), SLA_FILT4 (in), SLA_FILT5 (in), SLA_FILT6 (in), STP1CS (out), STP2CS (in), STP3CS (in), STP4CS (in), STP5CS (in), STP6CS (in), USB_VCC (in), USB_VCC (out), VN10 (in), VP10 (in), WD1 (in), WD2 (in), WD3 (in), WD4 (in), WD5 (in), WD6 (in)

### Nets
+3V3: C6.1 C12.1 C15.1 C16.1 C17.1 C18.1 C19.1 C21.1 C26.1 C47.1 C51.1 C52.2 C66.1 C73.1 CON1.2 CON2.4 CON2.7 ERASE1.P$2(P$5) L2.1 L3.1 L4.1 L7.1 R5.2 R9.2 R10.2 R12.2 R14.2 R27.2 R29.2 R36.2 R37.2 R47.2 R48.2 R49.2 R50.2 U2.1(VDD1) U5.1(VDD1) U6.15(VDDTX) U6.19(VDDRX) U6.20(VDDPLL) U6.25(VDDOSC) U6.28(VDD) U7.1(VDD1) U10.11(VDDIO1) U10.52(VDDBU) U10.57(VDDIN) U10.62(VDDIO2) U10.105(VDDIO3) U10.125(VDDIO4) U11.1(VDD1)
+5VA: C13.2 C14.1 C67.2 C68.1 L1.1 L6.1 L8.1 L9.1 U2.10(VE2) U3.8(VCC) U3.9(IOVCC) U5.10(VE2) U7.10(VE2) U8.8(VCC) U8.9(IOVCC) U11.10(VE2)
+15VA: C7.1 C8.2 C32.2 C33.1 C60.1 C61.2 C70.2 C71.1 U3.3(VDD) U3.5(VDD) U4.7(+VS) U8.3(VDD) U8.5(VDD) U9.7(+VS)
-15VA: C1.2 C2.1 C9.1 C10.2 C55.2 C56.1 C62.1 C63.2 U3.17(VSS) U3.18(VSS) U3.25(EP) U4.4(-VS) U4.9(EP) U8.17(VSS) U8.18(VSS) U8.25(EP) U9.4(-VS) U9.9(EP)
AGND: C1.1 C2.2 C7.2 C8.1 C9.2 C10.1 C11.2 C13.1 C14.2 C32.1 C33.2 C46.2 C55.1 C56.2 C58.1 C59.1 C60.2 C61.1 C62.2 C63.1 C65.2 C67.1 C68.2 C70.1 C71.2 C72.2 U2.9(GND2) U2.15(GND2) U3.15(DGND) U3.19(AGND) U5.9(GND2) U5.15(GND2) U7.9(GND2) U7.15(GND2) U8.15(DGND) U8.19(AGND) U11.9(GND2) U11.15(GND2)
DGND: C3.1 C4.2 C12.2 C15.2 C16.2 C17.2 C18.2 C19.2 C20.2 C21.2 C22.2 C23.2 C24.2 C25.2 C26.2 C27.2 C29.2 C30.2 C37.2 C38.2 C39.2 C40.2 C41.2 C42.2 C43.2 C44.2 C45.2 C47.2 C48.2 C49.2 C50.2 C51.2 C52.1 C53.2 C54.2 C64.1 C66.2 C73.2 CON1.6 CON2.2 CON2.10 HEARTBEAT1.C J1.10 J1.11 J1.S1 J1.S2 R13.1 R25.1 R30.1 RESET1.P$1(P$4) U2.2(GND1) U2.8(GND1) U5.2(GND1) U5.8(GND1) U6.2(VSS) U6.11(VSSRX) U6.18(VSSTX) U6.21(VSSPLL) U6.22(VSSOSC) U7.2(GND1) U7.8(GND1) U10.12(GND1) U10.33(GNDPLL) U10.44(GNDUTMI) U10.46(JTAGSEL) U10.54(GNDBU) U10.58(GND2) U10.74(GNDANA) U10.106(GND3) U10.126(GND4) U11.2(GND1) U11.8(GND1) X1.5(GND) X1.6(SHLD1) X1.7(SHLD2) X1.8(SHLD3) X1.9(SHLD4) Y2.2(GND) Y2.4(GND) Z1.2 Z2.2
Eth_GND: C69.1 J1.8(CHS_GROUND)
AVREF: C27.1 L4.2 U10.75(ADVREF)
CLR1*: R48.1 TP9.TP U5.4(VIB) U10.15(PD2)
CLR2*: R9.1 TP13.TP U10.19(PD6) U11.4(VIB)
DAC1_CS1: U2.7(VE1) U10.78(PA16)
DAC1_CS2: U5.7(VE1) U10.79(PA24)
DAC2_CS1: U7.7(VE1) U10.70(PA18)
DAC2_CS2: U10.71(PA19) U11.7(VE1)
ENC_CS: R25.2 U6.9(~{CS}) U10.141(PB22)
ERASE_S: ERASE1.P$1(P$4) U10.130(PC0)
ETH_CLK: U6.23(OSC1) U10.107(PA21)
ETH_RESET: R27.1 U6.10(~{RESET}) U10.140(PB14)
INT: R36.1 U6.4(~{INT}) U10.139(PC28)
LDAC1*: R49.1 TP8.TP U5.5(VIC) U10.14(PD1)
LDAC2*: R12.1 TP12.TP U10.18(PD5) U11.5(VIC)
LEDA: R26.2 U6.27(LEDA)
LEDB: R28.2 U6.26(LEDB)
LVDT1_OE1: U10.72(PA20)
MASTER-RESET: C6.2 CON1.5 CON2.6 R5.1 RESET1.P$2(P$5) U10.47(NRSTB)
MISO: CON1.1 R29.1 TP4.TP U2.6(VOD) U6.6(SO) U7.6(VOD) U10.108(PA25) ; port MISO
MOSI: CON1.4 TP5.TP U2.3(VIA) U6.7(SI) U7.3(VIA) U10.109(PA26) ; port MOSI
RESET1*: R47.1 TP10.TP U5.3(VIA) U10.16(PD3)
RESET2*: R14.1 TP14.TP U10.20(PD7) U11.3(VIA)
RX0: TP2.TP
SCLK: CON1.3 TP6.TP U2.4(VIB) U6.8(SCK) U7.4(VIB) U10.110(PA27) ; port SCLK
SYNC1*: R50.1 TP7.TP U2.5(VIC) U10.13(PD0)
SYNC2*: R10.1 TP11.TP U7.5(VIC) U10.17(PD4)
TCK: CON2.1 U10.28(PB28)
TDI: CON2.9 U10.29(PB29)
TDO: CON2.3 U10.30(PB30)
TMS: CON2.5 U10.31(PB31)
TX0: TP3.TP
USB_D+: R45.2 X1.3(D+)
USB_D-: R46.2 X1.2(D-)
VBG: C50.1 R13.2 U10.40(VBG)
VDDANA: C24.1 C25.1 L2.2 U10.73(VDDANA)
VDDOUT: C37.1 C38.1 C39.1 C40.1 C41.1 C42.1 C43.1 L5.1 U10.10(VDDCORE1) U10.45(VDDCORE2) U10.56(VDDOUT) U10.61(VDDCORE3) U10.104(VDDCORE4) U10.124(VDDCORE5)
VDDOUTMI: C22.1 C23.1 L3.2 U10.41(VDDUTMI)
VDDPLL: C29.1 C30.1 L5.2 U10.34(VDDPLL)
XIN: C45.1 U10.36(XIN) Y2.1(C1)
XIN32: C49.1 U10.48(XIN32) Y1.P$2
XOUT: C44.1 U10.35(XOUT) Y2.3(C2)
XOUT32: C48.1 U10.49(XOUT32) Y1.P$1
NetC3_2: C3.2 C4.1 U10.39(VBUS) X1.1(VBUS) ; port USB_VCC
NetC5_1: C5.1 TP1.TP U3.20(RFB) U4.6(VOUT) ; port DAC1 OUT
NetC5_2: C5.2 U3.24(INV) U4.2(-IN)
NetC6_1_2: U10.85(PA2) ; port SLA_FILT1
NetC6_2_2: U10.84(PA3) ; port SLA_FILT2
NetC6_3_2: U10.83(PA4) ; port SLA_FILT3
NetC6_4_2: U10.82(PA6) ; port SLA_FILT4
NetC6_5_2: U10.81(PA22) ; port SLA_FILT5
NetC6_6_2: U10.80(PA23) ; port SLA_FILT6
NetC11_1: C11.1 L1.2 U2.16(VDD2)
NetC46_1: C46.1 L6.2 U5.16(VDD2)
NetC53_1: C53.1 R21.1 R22.1
NetC54_1: C54.1 L7.2 R23.1 R24.1 T1.15(CT)
NetC57_1: C57.1 TP15.TP U8.20(RFB) U9.6(VOUT) ; port DAC2 OUT
NetC57_2: C57.2 U8.24(INV) U9.2(-IN)
NetC58_2: C58.2 U3.16(VREFN) U8.16(VREFN) ; port VN10
NetC59_2: C59.2 U3.2(VREFP) U8.2(VREFP) ; port VP10
NetC64_2: C64.2 U6.1(VCAP)
NetC65_1: C65.1 L8.2 U7.16(VDD2)
NetC69_2: C69.2 R31.2 R32.2 R33.2 R34.2
NetC72_1: C72.1 L9.2 U11.16(VDD2)
NetHEARTBEAT1_A: HEARTBEAT1.A R38.1
NetJ1_1: J1.1(TD+) T1.1(TD+)
NetJ1_2: J1.2(TD-) T1.3(TD-)
NetJ1_3: J1.3(RD+) T1.6(RD+)
NetJ1_4: J1.4(TCT) R32.1
NetJ1_5: J1.5(RCT) R31.1
NetJ1_6: J1.6(RD-) T1.8(RD-)
NetJ1_9: J1.9 R26.1
NetJ1_12: J1.12 R28.1
NetR8_1: R8.1 R46.1 U10.38(DHSDM) Z2.1 ; port D-
NetR8_2: R8.2 U10.43(DFSDM)
NetR11_1: R11.1 R45.1 U10.37(DHSDP) Z1.1 ; port D+
NetR11_2: R11.2 U10.42(DFSDP)
NetR21_2: R21.2 T1.11(RX+) U6.13(TPIN+)
NetR22_2: R22.2 T1.9(RX-) U6.12(TPIN-)
NetR23_2: R23.2 T1.16(TX+) U6.17(TPOUT+)
NetR24_2: R24.2 T1.14(TX-) U6.16(TPOUT-)
NetR30_2: R30.2 U6.14(RBIAS)
NetR33_1: R33.1 T1.2(CT)
NetR34_1: R34.1 T1.7(CT)
NetR37_1: R37.1 U10.53(FWUP)
NetR38_2: R38.2 U10.68(PB27)
NetU1_1_15: U10.138(PC27) ; port ERR1
NetU1_1_16: U10.136(PC25) ; port CLR1
NetU1_1_17: U10.137(PC26) ; port WD1
NetU1_1_22: U10.133(PC22) ; port STP1CS
NetU1_1_26: U10.134(PC23) ; port NXT1
NetU1_1_27: U10.135(PC24) ; port DIR1
NetU1_2_15: U10.128(PB10) ; port ERR2
NetU1_2_16: U10.123(PB8) ; port CLR2
NetU1_2_17: U10.127(PB9) ; port WD2
NetU1_2_18: U10.129(PB11) ; port HOLDCUR2
NetU1_2_22: U10.131(PC20) ; port STP2CS
NetU1_2_26: U10.121(PB6) ; port NXT2
NetU1_2_27: U10.122(PB7) ; port DIR2
NetU1_3_15: U10.66(PC8) ; port ERR3
NetU1_3_16: U10.64(PC6) ; port CLR3
NetU1_3_17: U10.65(PC7) ; port WD3
NetU1_3_18: U10.67(PC9) ; port HOLDCUR3
NetU1_3_22: U10.59(PC2) ; port STP3CS
NetU1_3_26: U10.60(PC3) ; port NXT3
NetU1_3_27: U10.63(PC5) ; port DIR3
NetU1_4_15: U10.94(PC12) ; port ERR4
NetU1_4_16: U10.92(PB21) ; port CLR4
NetU1_4_17: U10.93(PC11) ; port WD4
NetU1_4_18: U10.95(PC13) ; port HOLDCUR4
NetU1_4_22: U10.89(PB18) ; port STP4CS
NetU1_4_26: U10.90(PB19) ; port NXT4
NetU1_4_27: U10.91(PB20) ; port DIR4
NetU1_5_15: U10.100(PC18) ; port ERR5
NetU1_5_16: U10.98(PC16) ; port CLR5
NetU1_5_17: U10.99(PC17) ; port WD5
NetU1_5_18: U10.101(PC19) ; port HOLDCUR5
NetU1_5_22: U10.102(PC29) ; port STP5CS
NetU1_5_26: U10.96(PC14) ; port NXT5
NetU1_5_27: U10.97(PC15) ; port DIR5
NetU1_6_15: U10.119(PB4) ; port ERR6
NetU1_6_16: U10.114(PB1) ; port CLR6
NetU1_6_17: U10.118(PB3) ; port WD6
NetU1_6_18: U10.120(PB5) ; port HOLDCUR6
NetU1_6_22: U10.112(PA29) ; port STP6CS
NetU1_6_26: U10.113(PB0) ; port NXT6
NetU1_6_27: U10.115(PB2) ; port DIR6
NetU2_11: U2.11(VID) U3.11(SDO)
NetU2_12: U2.12(VOC) U3.14(~{SYNC})
NetU2_13: U2.13(VOB) U3.13(SCLK)
NetU2_14: U2.14(VOA) U3.12(SDIN)
NetU3_1: U3.1(VOUT) U4.3(+IN)
NetU3_4: U3.4(~{RESET}) U5.14(VOA)
NetU3_6: U3.6(~{CLR}) U5.13(VOB)
NetU3_7: U3.7(~{LDAC}) U5.12(VOC)
NetU7_11: U7.11(VID) U8.11(SDO)
NetU7_12: U7.12(VOC) U8.14(~{SYNC})
NetU7_13: U7.13(VOB) U8.13(SCLK)
NetU7_14: U7.14(VOA) U8.12(SDIN)
NetU8_1: U8.1(VOUT) U9.3(+IN)
NetU8_4: U8.4(~{RESET}) U11.14(VOA)
NetU8_6: U8.6(~{CLR}) U11.13(VOB)
NetU8_7: U8.7(~{LDAC}) U11.12(VOC)
NetU10_76: U10.76(PB15) ; port RELAY_CTRL_ISO1
NetU10_77: U10.77(PB16) ; port RELAY_CTRL_ISO2
NetU10_88: U10.88(PB17) ; port LVDT1_CS

Not connected (* = marked no-connect by the designer): C20 1; CON2 8; J1 7(NC)*; T1 4(NC)* 5(NC)* 10(CT)* 12(NC)* 13(NC)*; U3 10(DNC)* 21(DNC)* 22(DNC)* 23(DNC)*; U4 1(NC) 5(NC)* 8(~{PD})*; U5 6(VOD)* 11(VID)*; U6 3(CLKOUT)* 5(NC)* 24(OSC2)*; U8 10(DNC)* 21(DNC)* 22(DNC)* 23(DNC)*; U9 1(NC) 5(NC)* 8(~{PD})*; U10 1(PB26) 2(PA9) 3(PA10) 4(PA11) 5(PA12) 6(PA13) 7(PA14) 8(PA15) 9(PA17) 21(PD8) 22(PD9) 23(PA0) 24(PA1) 25(PA5) 26(PA7) 27(PA8) 32(PD10) 50(SHDN) 51(TST) 55(PC1) 69(NRST) 86(PB12) 87(PB13) 103(PC30) 111(PA28) 116(PC4) 117(PC10) 132(PC21) 142(PB23) 143(PB24) 144(PB25); U11 6(VOD)* 11(VID)*; X1 4(ID)

### Notes on the sheet
- (near C64) Low ESR
- (near CON1) SPI Programming
- (in symbol CMP-2000-05321-1) GND

### Library data of the parts
C1 C4 C7 C9 C11 C12 C14 C33 C46 C47 C51 C53-C55 C60 C62 C65 C66 C68 C71-C73 = CMP-1035-02587-1: CAP 100nF 25V ±5% 0603 (1608 Metric) Thickness 1mm SMD; Case-EIA: 0603; Tolerance: Â±5%; Case-Metric: 1608; Technology: SMT; Max Thickness: 1 mm; Rated Voltage: 25 V
C2 C3 C8 C10 C13 C32 C52 C56 C58 C59 C61 C63 C67 C70 = CMP-1036-04921-1: CAP 10uF 6.3V -20% to +80% 0805 (2012 Metric) Thickness 1.45mm SMD; Case-Metric: 2012; Case-EIA: 0805; Tolerance: -20% to +80%; Rated Voltage: 6.3 V; Max Thickness: 1.45 mm; Technology: SMT
C5 C57 = CMP-1036-00839-1: CAP 10pF 25V ±0.25pF 0805 (2012 Metric) Thickness 1mm SMD; Tolerance: Â±0.25pF; Case-Metric: 2012; Case-EIA: 0805; Rated Voltage: 25 V; Max Thickness: 1 mm; Technology: SMT
C6 C15-C27 C29 C30 C37-C43 C48-C50 = C-USC0805: CAPACITOR, American symbol
C44 C45 = C-USC1206: CAPACITOR, American symbol
C64 = CMP-1037-04965-1: CAP 10uF 6.3V -20% to +80% 1206 (3216 Metric) Thickness 1.9mm SMD; Case-Metric: 3216; Case-EIA: 1206; Tolerance: -20% to +80%; Rated Voltage: 6.3 V; Max Thickness: 1.9 mm; Technology: SMT
C69 = CMP-2000-05469-1: Chip Capacitor, 1 nF, +/- 10%, 2000 V, -55 to 125 degC, 1206 (3216 Metric), RoHS, Tape and Reel; Manufacturer: AVX; Dielectric: X7R; Rated Voltage: 2000V; Package Reference: 1206; Manufacturer URL: http://www.avx.com/; Datasheet URL: http://datasheets.avx.com/HV-FlexitermMLCC.pdf; Tolerance (%): ±10%; Datasheet Version: 01/2016; Package Description: 2-Pin Surface Mount Device, Body 3.3 x 1.7 mm; Case Size/Dimension: 1206; Mounting Technology: SurfaceMount
CON1 = CON06: CONNECTOR; MF: *; MPN: *; OC_FARNELL: unknown; OC_NEWARK: unknown
CON2 = CON10: CONNECTOR; MF: *; MPN: *; OC_FARNELL: unknown; OC_NEWARK: unknown
HEARTBEAT1 = LED0805: LED0603 - 0603 Surface Mount Package    2mA: Green LED - Low Power (3.9mcd, 2ma, 1.7Vf) - Digikey: 475-2709-2-ND  Orange LED - Low Power (9.8mcd, 2ma, 1.8Vf) - Digikey: 475-1194-2-ND  Red LED - Low Power (5mcd, 2ma, 1.8Vf) - Digikey: 475-1195-2-ND  Yellow LED - Low Power (7mcd, 2ma, 1.8Vf) - Digikey: 475-1196-2-ND       5mA: Blue LED - Low Power (17mcd, 5ma, 2.9Vf) - Digikey: LNJ937W8CRACT-ND    0805 - 0805 Surface Mount Package    2mA: Red LED (8.8mcd, 2mA, 1.8Vf, Clear) - Low Power [Digikey: 475-2510-1-ND]  Green LED (5mcd, 2mA, 1.8Vf, Clear) - Low Power [Digikey: 475-2730-1-ND]  Yellow LED (11.3mcd, 2mA, 1.8Vf, Clear) - Low Power [Digikey: 475-2555-1-ND]       20mA: Red LED (104mcd, 20mA, Diffused) - LS R976 [Digikey: 475-1278-6-ND]  Red LED (12mcd, 20mA, 2.0Vf, Clear) - APT2012EC [Digikey: 754-1128-1-ND]  Green LED (15mcd, 20mA, 2.2Vf, Clear) - APT2012GC [Digikey: 754-1131-1-ND]  Orange LED (160mcd, 20mA, 2.1Vf, Clear) - APT2012SECK [Digikey: 754-1130-1-ND]     1206 - 1206 Surface Mount Package  Green LED (26mcd, 20mA, Diffused) - LG N971  [Digikey: 475-1407-6-ND]  Red LED (15mcd, 20mA, Diffused) - LH N974 [Digikey: 475-1416-6-ND]
J1 = CMP-2000-05321-1: 10/100 Base-TX RJ45 1 x 1 Tab-Down with LEDs Integrated Magnetics Connector, 0 to 70 degC, 12-Pin THD, RoHS, Tube; Manufacturer: Pulse; Body Orientation: RightAngle; Number of Contacts: 8; Gender: F; Pitch: 2.54mm; Category: ConnectorTelephoneandTelecom; Package Description: 12-Pin Through Hole Device, Body 16.26 x 21.59 mm, Pitch 1.27 mm; Datasheet Version: Rev. D, 05/2006; Termination Method: Solder; Type: RJ-45; Package Reference: J0011D21BNL; Manufacturer URL: http://www.pulseelectronics.com/; Mounting: ThroughHole; Datasheet URL: http://datasheet.octopart.com/J0011D21BNL-Pulse-datasheet-120436.pdf
L1-L9 = WE-CBF_0805: SMD EMI Suppression Ferrite Beads - excellent anti-EMI properties - low DCR - impedances till 3000 ohms - rated current up to 6 A; NAME: *
R5 R9 R10 R12 R14 R29 R36 R47-R50 = R-EU_R0603: RESISTOR, European symbol
R8 R11 R13 R37 R38 = R-US_R0805: RESISTOR, American symbol
  R8 R11 R13: NAME: *
R21-R24 = CMP-1012-00363-1: 49R9 0.1W 1% 0603 (1608 Metric)  SMD; Case-Metric: 1608; Case-EIA: 0603; Power: 0.1 W; Tolerance: 1 %; Technology: SMT
R25 R27 = CMP-2000-06685-1: Chip Resistor, 10 KOhm, +/- 1%, 0.1 W, -55 to 155 degC, 0603 (1608 Metric), RoHS, Tape and Reel; Manufacturer: Rohm; Online Catalog: MCR03Series; Temperature Coefficient: ±100ppm/°C; EDA / CAD Models: DownloadfromAcceleratedDesigns; Other Names: RHM10.0KCFTR; Power (Watts): 0.1W,1/10W; Tolerance: ±1%; Operating Temperature: -55°C~155°C; Datasheet Version: Rev. F, 02/2015; Composition: ThickFilm; Height: 0.022"(0.55mm); Size / Dimension: 0.063"Lx0.031"W(1.60mmx0.80mm); Package Reference: 0603; Package / Case: 0603(1608Metric); Series: MCR; Supplier Device Package: 0603(1608Metric); Family: ChipResistor-SurfaceMount; Datasheet URL: http://rohmfs.rohm.com/en/products/databook/datasheet/passive/resistor/chip_resistor/mcr_g.pdf; Category: Resistors; Manufacturer URL: http://www.rohm.com/web/global/; Number of Terminations: 2; Standard Package: 5,000; Mounting Technology: SurfaceMount; Package Description: 2-Pin Surface Mount Device, Body 1.60 x 0.80 mm; Packaging: Tape&Reel(TR); Features: -
R26 R28 = CMP-1012-00491-1: 680R 0.1W 1% 0603 (1608 Metric)  SMD; Case-EIA: 0603; Case-Metric: 1608; Tolerance: 1 %; Technology: SMT; Power: 0.1 W
R30 = CMP-1012-00549-1: 2K32 0.1W 1% 0603 (1608 Metric)  SMD; Case-Metric: 1608; Case-EIA: 0603; Value: 2320.00 Ohm; Tolerance: 1 %; Power: 0.1 W; Technology: SMT
R31-R34 = CMP-1012-00383-1: 75R 0.1W 1% 0603 (1608 Metric)  SMD; Case-EIA: 0603; Case-Metric: 1608; Power: 0.1 W; Technology: SMT; Tolerance: 1 %
R45 R46 = CMP-1012-00035-1: 24R 0.1W 5% 0603 (1608 Metric)  SMD; Case-Metric: 1608; Case-EIA: 0603; Tolerance: 5 %; Technology: SMT; Power: 0.1 W
T1 = CMP-0840-00001-1: Magnetics Modules for LAN Application, 10/100 Base-T Magnetics Module, 1 Port, 0 to 70 degC, 16-Pin SMD, RoHS, Tape and Reel; Manufacturer: EPCOS; Inductance L: 350 uH min.; Turns Ratio: 1CT +/- 3%; Ports: 1; Voltage Test: 1500 V AC; Insertion loss: -1.0 dB max.; DatasheetVersion: 08/2012; ComponentLink3Description: Package Specification; PackageReference: B78476A8065A003-16; ComponentLink1URL: http://www.epcos.com/; ComponentLink1Description: Manufacturer URL; ComponentLink3URL: http://www.epcos.com/inf/30/ds/lan_mod/B78476A8065A003.pdf; ComponentLink2URL: http://www.epcos.com/inf/30/ds/lan_mod/B78476A8065A003.pdf; ComponentLink2Description: Datasheet; PackageDescription: 16-Pin Surface Mount Device, Body 12.7 x 7.11 mm, Pitch 1.27 mm; RoHS: TRUE; Mounting Technology: Surface Mount; Weight: 0.8 g; PartNumber: B78476A8065A003; PackageVersion: 08/2012; Packing: Tape and Reel; Operating Temperature Range: 0 to 70 degC
TP1-TP15 = PTR1PAD1-13: TEST PIN
U2 U5 U7 U11 = CMP-0534-00565-1: Quad Channel Digital Isolator, 2.5 KV rms Insulation Rating, 10 Mbps Data Rate, 50 ns Delay, Industrial, 16-pin SOIC (RW-16), Tube; Manufacturer: Analog Devices; Max Data Rate: 10Mbps; ComponentLink2URL: http://www.analog.com/static/imported-files/data_sheets/ADuM1400_1401_1402.pdf; ComponentLink5Description: URL Link2; ComponentLink3URL: http://www.analog.com/static/imported-files/packages/PKG_PDF/SOIC_WIDE%20%28RW%29/RW_16.pdf; DatasheetVersion: Rev. H; ComponentLink2Description: Datasheet; ComponentLink3Description: Package Specification; PartNumber: ADUM1401BRWZ; ComponentLink5URL: Reference Circuit:http://www.analog.com/en/interface-isolation/digital-isolators/adum1401/products/product.html#product-recommendations; Max Operating Temp (degreesC): 125; PackageReference: RW-16; PackageVersion: 032707-B, 03/2007; ComponentLink1Description: Manufacturer URL; Code_JEDEC: MS-013-AA; PackageDescription: 16-Pin Standard Small Outline Package, Body 10.3 x 7.5 mm, Pitch 1.27 mm; Mounting Technology: Surface Mount; ComponentLink1URL: http://www.analog.com/en/index.html; ComponentLink4Description: URL Link1; ComponentLink4URL: Product URL:http://www.analog.com/en/interface-isolation/digital-isolators/adum1401/products/product.html
U3 U8 = CMP-0318-00532-2: Single 20-Bit System Ready Voltage Output Digital-to-Analog Converter, -40 to +125 degC, CP-24-5, Pb-Free, Tray; Manufacturer: Analog Devices; Generic Part Number: AD5790; Resolution (Bits): 20; Single Supply: No; Max V+: 16.5V; # DAC Outputs: 1; PackageReference: CP-24-5; ComponentLink1URL: http://www.analog.com/en/index.html; ComponentLink1Description: Manufacturer URL; ComponentLink4Description: Product URL; DatasheetVersion: Rev.B; RevisionNote: Component URL fixed; RoHS: Y; ComponentLink4URL: http://www.analog.com/en/digital-to-analog-converters/da-converters/ad5790/products/product.html; PackageVersion: 04-11-2012-B; Packing: Tray; PackageDescription: 24-Lead Lead Frame Chip Scale Package [LFCSP_VQ] 4 x 5 mm Body, Very Thin Quad; PartNumber: AD5790BCPZ; ComponentLink3URL: http://www.analog.com/static/imported-files/packages/PKG_PDF/LFCSP(CP)/CP_24_5.pdf; Mounting Technology: Surface Mount; ComponentLink3Description: Package Specification; ComponentLink2Description: Datasheet; ComponentLink2URL: http://www.analog.com/static/imported-files/data_sheets/AD5790.pdf
U4 U9 = CMP-0384-01432-1: Single Channel Ultra Low Noise Operational Amplifier, 65 MHz BW, 55 V/us SR, Industrial, 8-pin SOIC (RD-8-1), Reel; Manufacturer: Analog Devices; Input Offset Voltage: 20uV; Input Bias Current: 100nA; Amplifiers Per Package: 1; V Span Min: 9V; Iq/Amp: 7.9mA; Small Signal Bandwidth: 65MHz; V Span Max: 33V; Slew Rate: 55V/us; ComponentLink3URL: http://www.analog.com/static/imported-files/packages/PKG_PDF/SOIC_ED(RD)/RD_8_1.pdf; Generic Part Number: ADA4898-1; DatasheetVersion: Rev. D; ComponentLink1URL: http://www.analog.com/en/index.html; ComponentLink1Description: Manufacturer URL; ComponentLink3Description: Package Specification; Code_JEDEC: MS-012-AA; ComponentLink2Description: Datasheet; PackageReference: RD-8-1; PackageDescription: 8-Pin Standard Small Outline Package, Body 4.9 x 3.9 mm, Pitch 1.27 mm; ComponentLink2URL: http://www.analog.com/static/imported-files/data_sheets/ADA4898-1_4898-2.pdf; PartNumber: ADA4898-1YRDZ-R7; PackageVersion: 060506-A; Packing: Reel; Mounting Technology: Surface Mount
U6 = CMP-0186-00068-2: Stand-Alone Ethernet Controller with SPI Interface, 28-Pin SSOP; ComponentLink2Description: Datasheet; PackageVersion: revBB, Aug-2009; ComponentLink2URL: http://ww1.microchip.com/downloads/en/DeviceDoc/39662c.pdf; ComponentLink1Description: Manufacturer URL; ComponentLink3URL: http://www.microchip.com/stellent/groups/techpub_sg/documents/packagingspec/en012702.pdf; Code_JEDEC: MS-150; RevisionNote: URLs added.; PackageReference: SSOP-SS28; PackageDescription: 28-Lead Plastic Shrink Small Outline (SS) - 5.3mm Body [SSOP]; ComponentLink3Description: Package Specification; ComponentLink1URL: http://www.microchip.com/; DatasheetVersion: revC, Jan-2008
U10 = ATSAM3X/AAU
X1 = CMP-2000-05407-1: Surface Mount Type B Mini USB, 5 Positions, 0.8 mm Pitch, 0 to 50 degC, RoHS, Tape and Reel; Manufacturer: TE Connectivity; Number of Contacts: 5; Pitch: 0.8mm; Body Orientation: RightAngle; Number of Ports: 1; Gender: RCP; Manufacturer URL: http://www.te.com/; Color: Black; Packaging: TapeandReel; Datasheet Version: Rev. B1, 07/2010; Housing Material: Thermoplastic; Termination Method: Solder; Part No: 1734035-2; Contact Plating: GoldOverNickel; Dimension: 4.14mm; Maximum Current Rating: N/A; Contact Material: PhosphorBronze; Number of Terminals: 5; Type: USB; Mounting: SurfaceMount; Datasheet URL: https://datasheet.ciiva.com/11759/0900766b80ed62f8-11759638.pdf; Operating Temperature: N/A; RoHS: Yes; Maximum Voltage Rating: N/A
Y1 = ARDUINO_WIFI_SHIELD_V018_TG_RESONATOR_EPSON_FC_145: NAME: *; 1: 1; 2: 2
Y2 = CRYSTAL-3.2-2.5: NAME: *; 1: 1; 2: 2; 3: 3
Z1 Z2 = VARISTORCN0603: VARISTOR; NAME: *
ERASE1 RESET1 = PUCHBUTTON: BUTTON: *
  ERASE1: ERASE: *
  RESET1: RESET: *

## Sheet LVDT Driver.SchDoc
size A3
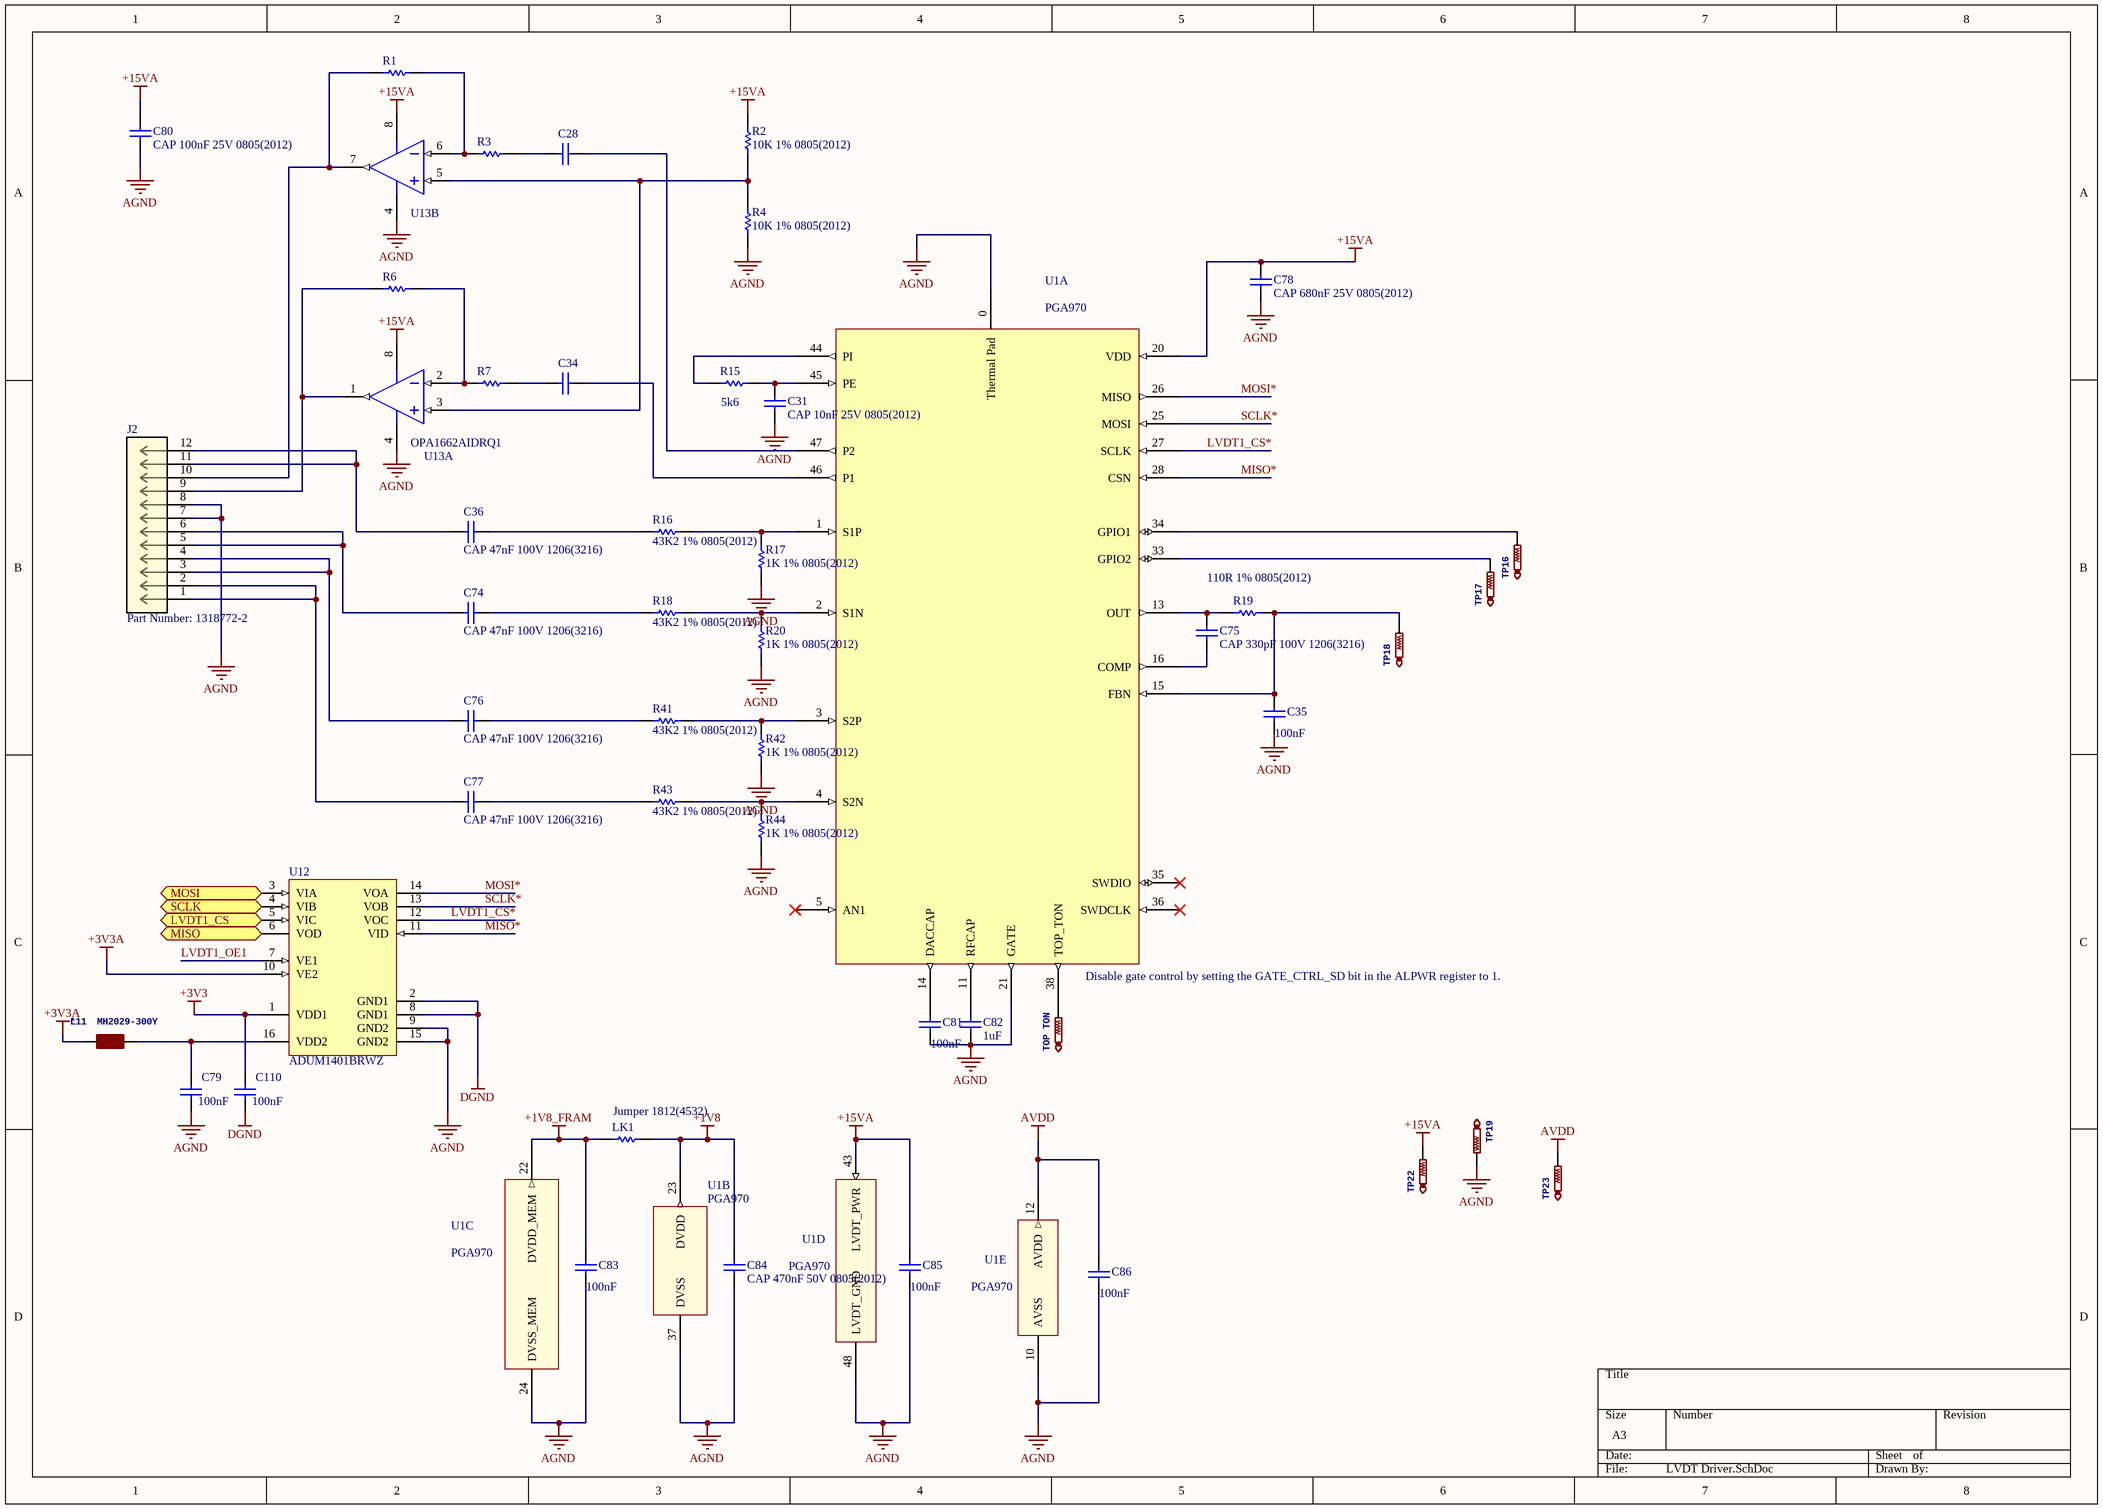
[diagram p8: LVDT Driver.SchDoc]

### Parts
C28  C1206C474K5RACTU  [CAPC3216X100X50LL20T25]  (value not drawn)
C31  CAP 10nF 25V 0805(2012)  [CAPC0805(2012)75_L]
C34  C1206C474K5RACTU  [CAPC3216X100X50LL20T25]  (value not drawn)
C35  100nF  [CAPC0805(2012)75_N]
C36  CAP 47nF 100V 1206(3216)  [CAPC1206(3216)100_L]
C74  CAP 47nF 100V 1206(3216)  [CAPC1206(3216)100_L]
C75  CAP 330pF 100V 1206(3216)  [CAPC1206(3216)170_L]
C76  CAP 47nF 100V 1206(3216)  [CAPC1206(3216)100_L]
C77  CAP 47nF 100V 1206(3216)  [CAPC1206(3216)100_L]
C78  CAP 680nF 25V 0805(2012)  [CAPC0805(2012)100_N]
C79  value 100nF  [CAPC0603(1608)100_N]  (hidden comment: CAP 100nF 25V 0603(1608))
C80  CAP 100nF 25V 0805(2012)  [CAPC0805(2012)75_N]
C81  100nF  [CAPC0805(2012)75_N]
C82  value 1uF  [CAPC2220(5750)230_L]  (hidden comment: CAP 4.7uF 50V 2220(5750))
C83  100nF  [CAPC0805(2012)75_N]
C84  CAP 470nF 50V 0805(2012)  [CAPC0805(2012)145_M]
C85  100nF  [CAPC0805(2012)75_N]
C86  100nF  [CAPC0805(2012)75_N]
C110  value 100nF  [CAPC0603(1608)100_N]  (hidden comment: CAP 100nF 25V 0603(1608))
J2  Part Number: 1318772-2  [CONN12_1318772]
L11  MH2029-300Y  [0805]
LK1  Jumper 1812(4532)  [RESC1812(4532)_M]
R1  510K 1% 0805(2012)  [RESC0805(2012)_L]  (value not drawn)
R2  10K 1% 0805(2012)  [RESC0805(2012)_M]
R3  31K6 1% 0805(2012)  [RESC0805(2012)_N]  (value not drawn)
R4  10K 1% 0805(2012)  [RESC0805(2012)_M]
R6  510K 1% 0805(2012)  [RESC0805(2012)_L]  (value not drawn)
R7  31K6 1% 0805(2012)  [RESC0805(2012)_N]  (value not drawn)
R15  value 5k6  [RESC0805(2012)_L]  (hidden comment: 5K6 1% 0805(2012))
R16  43K2 1% 0805(2012)  [RESC0805(2012)_L]
R17  1K 1% 0805(2012)  [RESC0805(2012)_M]
R18  43K2 1% 0805(2012)  [RESC0805(2012)_L]
R19  110R 1% 0805(2012)  [RESC0805(2012)_L]
R20  1K 1% 0805(2012)  [RESC0805(2012)_M]
R41  43K2 1% 0805(2012)  [RESC0805(2012)_L]
R42  1K 1% 0805(2012)  [RESC0805(2012)_M]
R43  43K2 1% 0805(2012)  [RESC0805(2012)_L]
R44  1K 1% 0805(2012)  [RESC0805(2012)_M]
TOP_TON  PTR1PAD1-13  [P1-13]  (value not drawn)
TP16  PTR1PAD1-13  [P1-13]  (value not drawn)
TP17  PTR1PAD1-13  [P1-13]  (value not drawn)
TP18  PTR1PAD1-13  [P1-13]  (value not drawn)
TP19  PTR1PAD1-13  [P1-13]  (value not drawn)
TP22  PTR1PAD1-13  [P1-13]  (value not drawn)
TP23  PTR1PAD1-13  [P1-13]  (value not drawn)
U1  PGA970  [PHP0048A_L]  (parts A,B,C,D,E of 6)
U12  ADUM1401BRWZ  [ADI-RW-16_M]
U13  OPA1662AIDRQ1  [D0008A_L]  (parts A,B of 2)

### Ports
LVDT1_CS (in), MISO (out), MOSI (in), SCLK (in)

### Nets
+1V8: C84.2 LK1.2 U1.23(DVDD)
+1V8_FRAM: C83.2 LK1.1 U1.22(DVDD_MEM)
+3V3: C110.1 U12.1(VDD1)
+3V3A: L11.1 U12.10(VE2)
+15VA: C78.2 C80.2 C85.2 R2.2 TP22.TP U1.20(VDD) U1.43(LVDT_PWR) U13.8(V+)
AGND: C31.1 C35.1 C78.1 C79.2 C80.1 C81.1 C82.1 C83.1 C84.1 C85.1 C86.1 J2.7 J2.8 R4.1 R17.1 R20.1 R42.1 R44.1 TP19.TP U1.0(Thermal_Pad) U1.10(AVSS) U1.21(GATE) U1.24(DVSS_MEM) U1.37(DVSS) U1.48(LVDT_GND) U12.9(GND2) U12.15(GND2) U13.4(V-)
AVDD: C86.2 TP23.TP U1.12(AVDD)
DGND: C110.2 U12.2(GND1) U12.8(GND1)
LVDT1_CS*: U1.27(SCLK) U12.12(VOC)
LVDT1_OE1: U12.7(VE1)
MISO: U12.6(VOD) ; port MISO
MISO*: U1.28(CSN) U12.11(VID)
MOSI: U12.3(VIA) ; port MOSI
MOSI*: U1.26(MISO) U12.14(VOA)
SCLK: U12.4(VIB) ; port SCLK
SCLK*: U1.25(MOSI) U12.13(VOB)
NetC28_1: C28.1 R3.2
NetC28_2: C28.2 U1.47(P2)
NetC31_2: C31.2 R15.2 U1.45(PE)
NetC34_1: C34.1 R7.2
NetC34_2: C34.2 U1.46(P1)
NetC35_2: C35.2 R19.2 TP18.TP U1.15(FBN)
NetC36_1: C36.1 J2.11 J2.12
NetC36_2: C36.2 R16.1
NetC74_1: C74.1 J2.5 J2.6
NetC74_2: C74.2 R18.1
NetC75_1: C75.1 U1.16(COMP)
NetC75_2: C75.2 R19.1 U1.13(OUT)
NetC76_1: C76.1 J2.3 J2.4
NetC76_2: C76.2 R41.1
NetC77_1: C77.1 J2.1 J2.2
NetC77_2: C77.2 R43.1
NetC79_1: C79.1 L11.2 U12.16(VDD2)
NetC81_2: C81.2 U1.14(DACCAP)
NetC82_2: C82.2 U1.11(RFCAP)
NetJ2_9: J2.9 R6.1 U13.1(OUT_A)
NetJ2_10: J2.10 R1.1 U13.7(OUT_B)
NetR1_2: R1.2 R3.1 U13.6(IN_B-)
NetR2_1: R2.1 R4.2 U13.3(IN_A+) U13.5(IN_B+)
NetR6_2: R6.2 R7.1 U13.2(IN_A-)
NetR15_1: R15.1 U1.44(PI)
NetR16_2: R16.2 R17.2 U1.1(S1P)
NetR18_2: R18.2 R20.2 U1.2(S1N)
NetR41_2: R41.2 R42.2 U1.3(S2P)
NetR43_2: R43.2 R44.2 U1.4(S2N)
NetTOP_TON_TP: TOP_TON.TP U1.38(TOP_TON)
NetTP16_TP: TP16.TP U1.34(GPIO1)
NetTP17_TP: TP17.TP U1.33(GPIO2)
NetU10_88: U12.5(VIC) ; port LVDT1_CS

Not connected (* = marked no-connect by the designer): U1 5(AN1)* 35(SWDIO)* 36(SWDCLK)*

### Notes on the sheet
- (near U1) Disable gate control by setting the GATE_CTRL_SD bit in the ALPWR register to 1.

### Library data of the parts
C28 C34 = CMP-2000-06016-1: Chip Capacitor, 470 nF, +/- 10%, 50 V, -55 to 125 degC, 1206 (3216 Metric), RoHS, Tape and Reel; Manufacturer: Kemet; Case Length: 3.2mm; Class: 2; Case Height: 0.9mm; Capacitance - pF: 470000pF; Capacitance - nF: 470nF; Capacitance: 0.47uF; Dielectric: X7R; Voltage Rating DC: 50V; Case Width: 1.6mm; Temperature Coefficient / Code: +/-15%; Type: SMDMLCCsX7R,Commercial; Manufacturer URL: http://www.kemet.com/; Maximum Operating Temperature: +125C; Minimum Operating Temperature: -55C; Brand: Kemet; Case Code - in: 1206; Datasheet Version: 02/2016; Case Code - mm: 3216; Series: C1206C; Mounting Technology: SurfaceMount; Package Reference: 1206; Termination Style: SMD/SMT; Tolerance: 10%; Datasheet URL: http://www.kemet.com/docfinder?Partnumber=C1206C106K8RACTU; Dimensions: 1.6mmWx3.2mmLx0.9mmH; Packaging: Reel; Factory Pack Quantity: 4000; Product Category: MultilayerCeramicCapacitorsMLCC-SMD/SMT; RoHS: Details; Operating Temperature Range: -55Cto+125C; Product: GeneralTypeMLCCs; Package Description: 2-Pin Surface Mount Device, Body 3.2 x 1.6 mm; Package / Case: 1206(3216metric); Voltage Rating: 50V
C31 = CMP-1036-03827-1: CAP 10nF 25V ±5% 0805 (2012 Metric) Thickness 0.75mm SMD; Case-EIA: 0805; Tolerance: Â±5%; Case-Metric: 2012; Rated Voltage: 25 V; Value: 10nF; Technology: SMT; Max Thickness: 0.75 mm
C35 C80 C81 C83 C85 C86 = CMP-1036-04415-1: CAP 100nF 25V -20% to +80% 0805 (2012 Metric) Thickness 0.75mm SMD; Case-EIA: 0805; Case-Metric: 2012; Rated Voltage: 25 V; Value: 100nF; Tolerance: -20% to +80%; Technology: SMT; Max Thickness: 0.75 mm
C36 C74 C76 C77 = CMP-1037-04001-1: CAP 47nF 100V ±20% 1206 (3216 Metric) Thickness 1mm SMD; Tolerance: Â±20%; Case-Metric: 3216; Case-EIA: 1206; Value: 47nF; Rated Voltage: 100 V; Max Thickness: 1 mm; Technology: SMT
C75 = CMP-1037-02011-1: CAP 330pF 100V ±1% 1206 (3216 Metric) Thickness 1.7mm SMD; Tolerance: Â±1%; Case-Metric: 3216; Case-EIA: 1206; Rated Voltage: 100 V; Max Thickness: 1.7 mm; Value: 330pF; Technology: SMT
C78 = CMP-1036-04706-1: CAP 680nF 25V ±10% 0805 (2012 Metric) Thickness 1mm SMD; Case-EIA: 0805; Tolerance: Â±10%; Case-Metric: 2012; Rated Voltage: 25 V; Value: 680nF; Technology: SMT; Max Thickness: 1 mm
C79 C110 = CMP-1035-02587-1: CAP 100nF 25V ±5% 0603 (1608 Metric) Thickness 1mm SMD; Case-EIA: 0603; Tolerance: Â±5%; Case-Metric: 1608; Technology: SMT; Max Thickness: 1 mm; Rated Voltage: 25 V
C82 = CMP-1042-00755-1: CAP 4.7uF 50V ±10% 2220 (5750 Metric) Thickness 2.2mm SMD; Case-Metric: 5750; Tolerance: Â±10%; Case-EIA: 2220; Rated Voltage: 50 V; Max Thickness: 2.2 mm; Technology: SMT
C84 = CMP-1036-04654-1: CAP 470nF 50V ±10% 0805 (2012 Metric) Thickness 1.45mm SMD; Case-EIA: 0805; Tolerance: Â±10%; Case-Metric: 2012; Rated Voltage: 50 V; Value: 470nF; Technology: SMT; Max Thickness: 1.45 mm
J2 = 1318772-2: 025 CAP HSG ASSY 12P; Vendor: TE Connectivity; ROWS/CONFIG: 2; PITCH(MM): 0.087; POSITIONS: 12; Built_By: EMA_UL_Team; Copyright: Copyright (C) 2016 Accelerated Designs. All rights reserved; Manufacturer_Part_Number: 1318772-2; TE_Part_Number: 1318772-2; PRODUCT: -; Type: DEV; RefDes: RefDes; Value: Value
L11 = WE-CBF_0805: SMD EMI Suppression Ferrite Beads - excellent anti-EMI properties - low DCR - impedances till 3000 ohms - rated current up to 6 A; NAME: *
LK1 = CMP-1016-00001-1: Jumper 1812 (4532 Metric); Tolerance: None; Case-EIA: 1812; Value: 0.00 Ohm; Case-Metric: 4532; Technology: SMT; Power: None
R1 R6 = CMP-1013-00816-1: 510K 0.125W 1% 0805 (2012 Metric)  SMD; Case-Metric: 2012; Value: 510000.00 Ohm; Case-EIA: 0805; Power: 0.125 W; Technology: SMT; Tolerance: 1 %
R2 R4 = CMP-1013-00623-1: 10K 0.125W 1% 0805 (2012 Metric)  SMD; Value: 10000.00 Ohm; Case-Metric: 2012; Case-EIA: 0805; Tolerance: 1 %; Power: 0.125 W; Technology: SMT
R3 R7 = CMP-1013-00678-1: 31K6 0.125W 1% 0805 (2012 Metric)  SMD; Case-EIA: 0805; Case-Metric: 2012; Value: 31600.00 Ohm; Tolerance: 1 %; Technology: SMT; Power: 0.125 W
R15 = CMP-1013-00595-1: 5K6 0.125W 1% 0805 (2012 Metric)  SMD; Case-EIA: 0805; Case-Metric: 2012; Technology: SMT; Power: 0.125 W; Tolerance: 1 %
R16 R18 R41 R43 = CMP-1013-00695-1: 43K2 0.125W 1% 0805 (2012 Metric)  SMD; Case-EIA: 0805; Case-Metric: 2012; Value: 43200.00 Ohm; Technology: SMT; Power: 0.125 W; Tolerance: 1 %
R17 R20 R42 R44 = CMP-1013-00510-1: 1K 0.125W 1% 0805 (2012 Metric)  SMD; Case-Metric: 2012; Value: 1000.00 Ohm; Case-EIA: 0805; Tolerance: 1 %; Power: 0.125 W; Technology: SMT
R19 = CMP-1013-00401-1: 110R 0.125W 1% 0805 (2012 Metric)  SMD; Value: 110.00 Ohm; Case-Metric: 2012; Case-EIA: 0805; Technology: SMT; Tolerance: 1 %; Power: 0.125 W
TOP_TON TP16-TP19 TP22 TP23 = PTR1PAD1-13: TEST PIN
U12 = CMP-0534-00565-1: Quad Channel Digital Isolator, 2.5 KV rms Insulation Rating, 10 Mbps Data Rate, 50 ns Delay, Industrial, 16-pin SOIC (RW-16), Tube; Manufacturer: Analog Devices; Max Data Rate: 10Mbps; ComponentLink2URL: http://www.analog.com/static/imported-files/data_sheets/ADuM1400_1401_1402.pdf; ComponentLink5Description: URL Link2; ComponentLink3URL: http://www.analog.com/static/imported-files/packages/PKG_PDF/SOIC_WIDE%20%28RW%29/RW_16.pdf; DatasheetVersion: Rev. H; ComponentLink2Description: Datasheet; ComponentLink3Description: Package Specification; PartNumber: ADUM1401BRWZ; ComponentLink5URL: Reference Circuit:http://www.analog.com/en/interface-isolation/digital-isolators/adum1401/products/product.html#product-recommendations; Max Operating Temp (degreesC): 125; PackageReference: RW-16; PackageVersion: 032707-B, 03/2007; ComponentLink1Description: Manufacturer URL; Code_JEDEC: MS-013-AA; PackageDescription: 16-Pin Standard Small Outline Package, Body 10.3 x 7.5 mm, Pitch 1.27 mm; Mounting Technology: Surface Mount; ComponentLink1URL: http://www.analog.com/en/index.html; ComponentLink4Description: URL Link1; ComponentLink4URL: Product URL:http://www.analog.com/en/interface-isolation/digital-isolators/adum1401/products/product.html
U13 = CMP-0271-00139-3: Automotive Catalog, Sound Plus, Low-Power, Low-Noise and Distortion, Audio Operational Amplifier, 3 to 36 V, -40 to 85 degC, 8-pin SOIC (D8), Green (RoHS & no Sb/Br); Manufacturer: Texas Instruments; GBW(Typ)(MHz): 22; Packing: LARGE T&R; Number of Channels: 2; Sub Family: High Supply Voltage Amplifier (>=30V), Low Noise Amp (<=10nV/rtHz), Precision Amplifier; Slew Rate(Typ)(V/us): 17; IIB(Max)(pA): 1200000; Vio (25C)(Max)(mV): 1.5; Total Supply Voltage(Min)(+5V is 5, +/-5V is 10): 3; Total Supply Voltage(Max)(+5V is 5, +/-5V is 10): 36; CMRR(Min)(dB): 106; Iq per channel(Max)(mA): 1.8; ComponentLink3URL: http://www.ti.com/litv/pdf/msoi002j; Rating: Automotive; Eco-Plan: Green (RoHS & no Sb/Br); PackageDescription: 8-Pin Plastic Small Outline, Body 4.9 x 3.9 mm, Pitch 1.27 mm; Mounting Technology: Surface Mount; ComponentLink1Description: Manufacturer URL; ComponentLink2Description: Datasheet; PackageReference: D0008A; ComponentLink2URL: http://www.ti.com/lit/ds/symlink/opa1662-q1.pdf; PackageVersion: 4040047-3/M, 06/2011; ComponentLink1URL: http://www.ti.com/; DatasheetVersion: SLOS805B; Code_JEDEC: MS-012; ComponentLink3Description: Package Specification; PartNumber: OPA1662AIDRQ1; Offset Drift(Typ)(uV/C): 2; PartId: 1